# Altium project XP-LRCU-L LoadBox-wiring drawing.PrjPcb
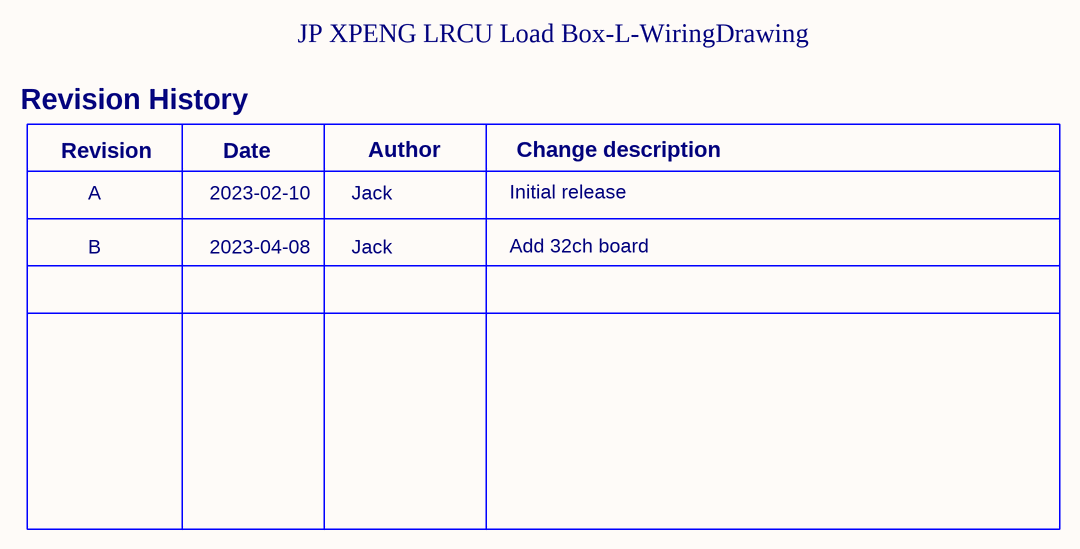
[diagram p0: 0_wiring drawing.SchDoc]
6 sheets, 242 parts. Net scope: global (net labels, ports and power ports of the same name join across sheets).
Sheets:
  0_wiring drawing.SchDoc
  1_wiring drawing.SchDoc
  2_wiring drawing.SchDoc
  3_wiring drawing.SchDoc
  4_wiring drawing.SchDoc
  5_wiring drawing.SchDoc

## Sheet 0_wiring drawing.SchDoc: History
size A4; CheckedBy: Among; DrawnBy: Jack; Address1: 1; Address2: 2; Address3: 3; Address4: 4; DocumentNumber: 04-TE-42-4015-0PA-A; Revision: B; SheetNumber: 1; SheetTotal: 5; SheetSize: A4; CheckedByDate: 2022-01-11; DrawByDate: 2022-01-11; SiteName: Huangpu Test Development; ProjectName: 19205_BMW CCU DDR PCBA FT fixture wiring

### Notes on the sheet
- JP XPENG LRCU Load Box-L-WiringDrawing
- Revision History
- Revision
- Date
- Author
- Change description
- A
- B
- 2023-02-10
- 2023-04-08
- Jack
- Initial release
- Add 32ch board
- Document Number:
- Project Name:
- Rev:
- Drawn By:
- Date:
- Titile:
- Checked By:
- Sheet:
- Of

## Sheet 1_wiring drawing.SchDoc: POWER & CAN
size A2; ApprovedBy: Approved By; CheckedBy: Sky; DrawnBy: Jack; Address1: 1; Address2: 2; Address3: 3; Address4: 4; DocumentNumber: 04-TE-42-4015-0PA-A; Revision: B; SheetNumber: 2; SheetTotal: 6; SheetSize: A2; CheckedByDate: 2022-11-19; DrawByDate: 2022-11-17; SiteName: EMS TD Huangpu; PageSetup: Record=PageOptions|CenterHorizontal=True|CenterVertical=True|PrintScale=0.73|XCorrection=1.00|YCorrection=1.00|PrintKind=0|BorderSize=5000000|LeftOffset=0|BottomOffset=0|Orientation=2|PaperLength=1000|PaperWidth=1000|Scale=100|PaperSource=15|PrintQuality=1200|MediaType=1|DitherType=10|PaperKind=A3|PrintScaleMode=1; ProjectName: 19205_BMW CCU DDR PCBA FT fixture wiring
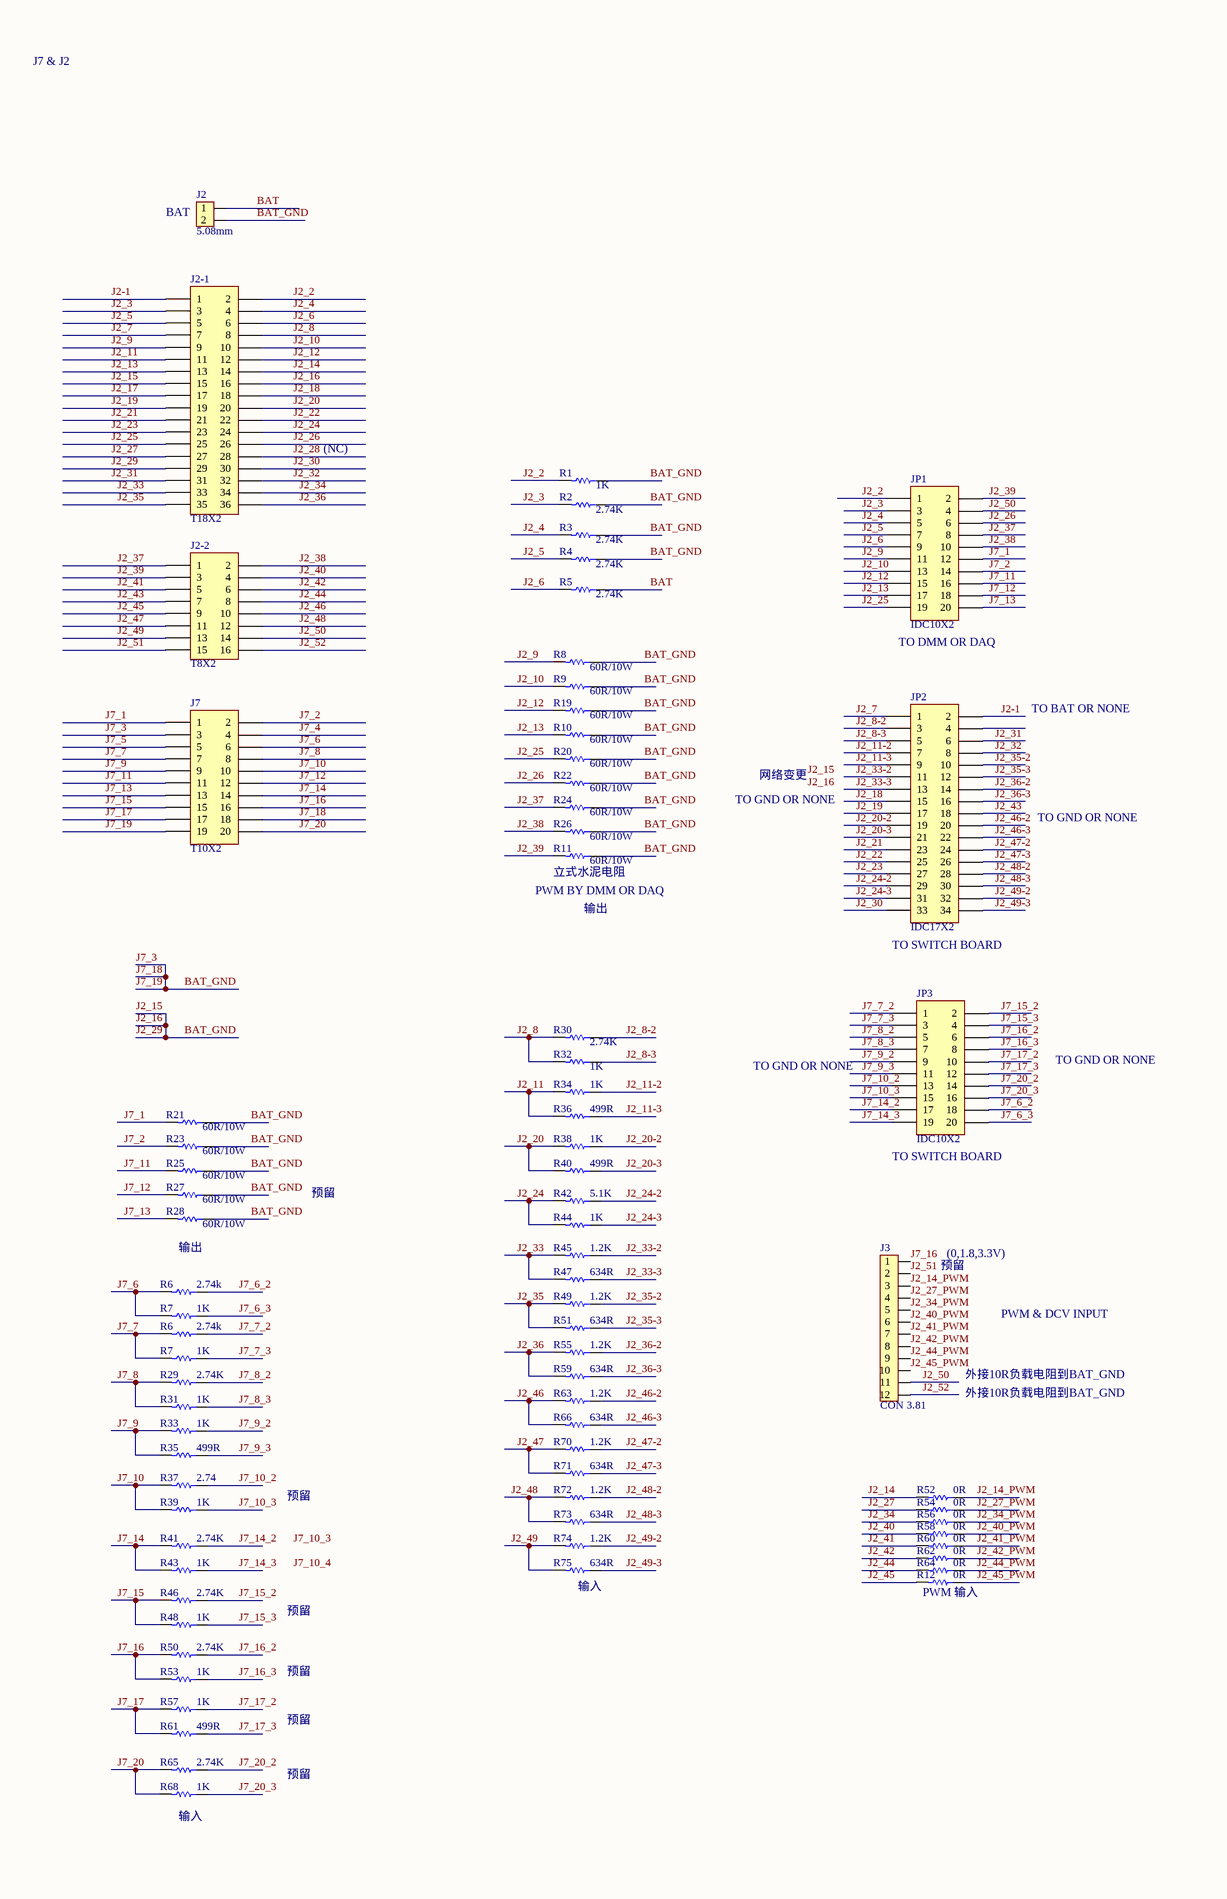
[diagram p1: 1_wiring drawing.SchDoc, left]
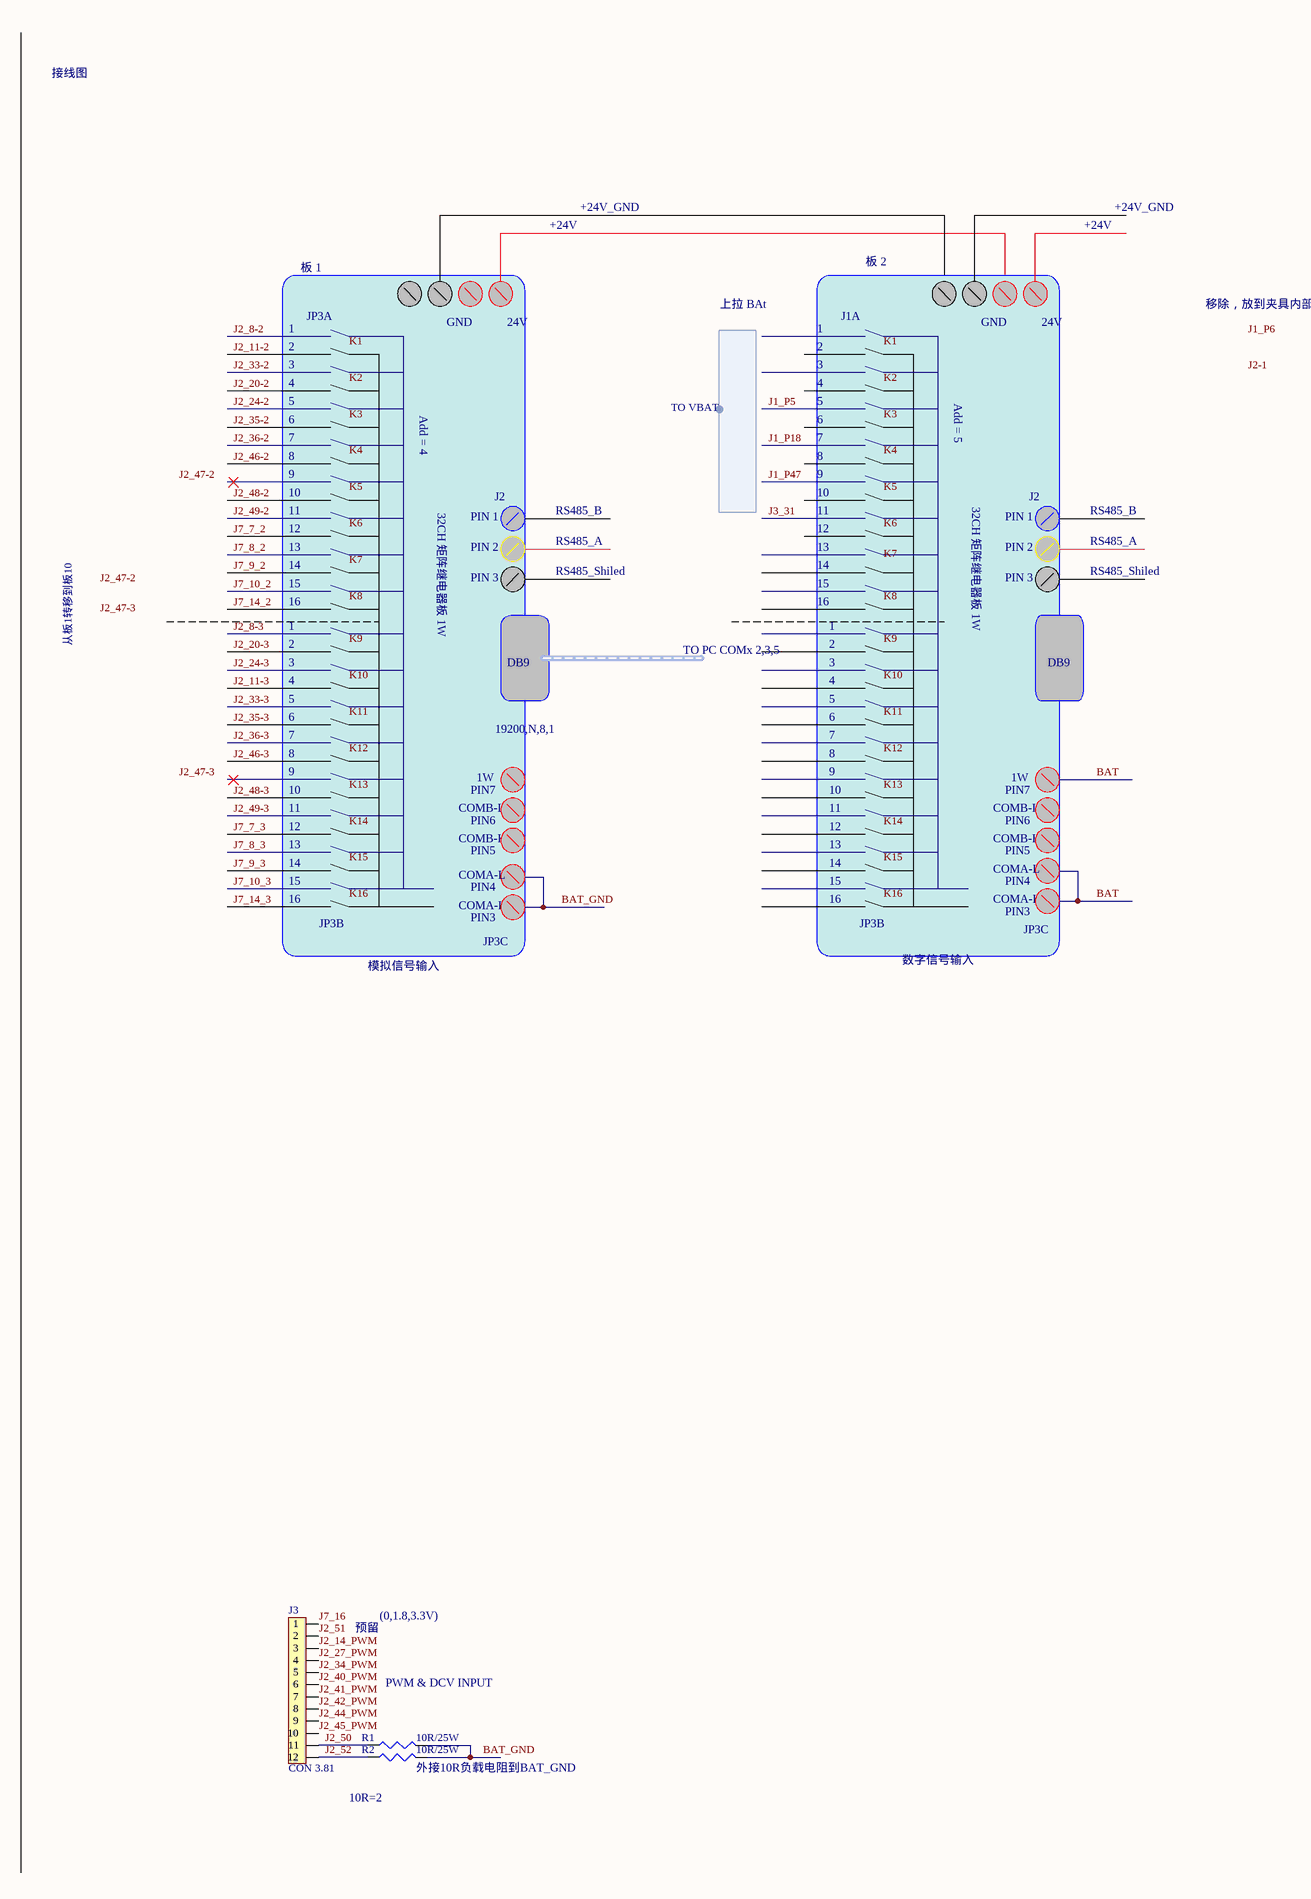
[diagram p2: 1_wiring drawing.SchDoc, right]

### Parts
(Parts that share a designator on the sheet are numbered #1, #2 ... from top to bottom, then left to right.)
J2  5.08mm  [3.81mm-2]
J2-1  T18X2  [T18X2-bend]
J2-2  T8X2
J3#1  CON 3.81  [3.81mm-12]
J3#2  CON 3.81  [3.81mm-12]
J7  T10X2  [T10X2-bend]
JP1#1  IDC10X2  [IDC20]
JP2  IDC17X2  [IDC34]
JP3  IDC10X2  [IDC20]
R1#1  1K  [AXIAL-0.25W]
R1#2  10R/25W  [R AXIAL0.4]
R2#1  2.74K  [AXIAL-0.25W]
R2#2  10R/25W  [R AXIAL0.4]
R3#1  2.74K  [AXIAL-0.25W]
R4#1  2.74K  [AXIAL-0.25W]
R5#1  2.74K  [AXIAL-0.25W]
R6#1  2.74k  [AXIAL-0.25W]
R6#2  2.74k  [AXIAL-0.25W]
R7#1  1K  [AXIAL-0.25W]
R7#2  1K  [AXIAL-0.25W]
R8#1  60R/10W  [立式10W]
R9#1  60R/10W  [立式10W]
R10#1  60R/10W  [立式10W]
R11#1  60R/10W  [立式10W]
R12#1  0R  [AXIAL-0.25W]
R19#1  60R/10W  [立式10W]
R20  60R/10W  [立式10W]
R21  60R/10W  [立式10W]
R22  60R/10W  [立式10W]
R23  60R/10W  [立式10W]
R24  60R/10W  [立式10W]
R25  60R/10W  [立式10W]
R26  60R/10W  [立式10W]
R27  60R/10W  [立式10W]
R28  60R/10W  [立式10W]
R29  2.74K  [AXIAL-0.25W]
R30  2.74K  [AXIAL-0.25W]
R31  1K  [AXIAL-0.25W]
R32  1K  [AXIAL-0.25W]
R33  1K  [AXIAL-0.25W]
R34  1K  [AXIAL-0.25W]
R35  499R  [AXIAL-0.25W]
R36  499R  [AXIAL-0.25W]
R37  2.74  [AXIAL-0.25W]
R38  1K  [AXIAL-0.25W]
R39  1K  [AXIAL-0.25W]
R40  499R  [AXIAL-0.25W]
R41  2.74K  [AXIAL-0.25W]
R42  5.1K  [AXIAL-0.25W]
R43  1K  [AXIAL-0.25W]
R44  1K  [AXIAL-0.25W]
R45  1.2K  [AXIAL-0.25W]
R46  2.74K  [AXIAL-0.25W]
R47  634R  [AXIAL-0.25W]
R48  1K  [AXIAL-0.25W]
R49  1.2K  [AXIAL-0.25W]
R50  2.74K  [AXIAL-0.25W]
R51  634R  [AXIAL-0.25W]
R52  0R  [AXIAL-0.25W]
R53  1K  [AXIAL-0.25W]
R54  0R  [AXIAL-0.25W]
R55  1.2K  [AXIAL-0.25W]
R56  0R  [AXIAL-0.25W]
R57  1K  [AXIAL-0.25W]
R58  0R  [AXIAL-0.25W]
R59  634R  [AXIAL-0.25W]
R60  0R  [AXIAL-0.25W]
R61  499R  [AXIAL-0.25W]
R62  0R  [AXIAL-0.25W]
R63  1.2K  [AXIAL-0.25W]
R64  0R  [AXIAL-0.25W]
R65  2.74K  [AXIAL-0.25W]
R66  634R  [AXIAL-0.25W]
R68  1K  [AXIAL-0.25W]
R70  1.2K  [AXIAL-0.25W]
R71  634R  [AXIAL-0.25W]
R72  1.2K  [AXIAL-0.25W]
R73  634R  [AXIAL-0.25W]
R74  1.2K  [AXIAL-0.25W]
R75  634R  [AXIAL-0.25W]

### Harnesses
TO VBAT: 

### Nets
BAT_GND: J2.2 J2-1.15 J2-1.16 J2-1.29 J7.3 J7.18 J7.19 R1#1.2 R1#2.2 R2#1.2 R2#2.2 R3#1.2 R4#1.2 R8#1.2 R9#1.2 R10#1.2 R11#1.2 R19#1.2 R20.2 R21.2 R22.2 R23.2 R24.2 R25.2 R26.2 R27.2 R28.2  [also labelled J2_15, J2_16, J2_29, J7_18, J7_19, J7_3]
BAT: J2.1 R5#1.2
J2-1: J2-1.1 JP2.2
J2_2: J2-1.2 JP1#1.1 R1#1.1
J2_3: J2-1.3 JP1#1.3 R2#1.1
J2_4: J2-1.4 JP1#1.5 R3#1.1
J2_5: J2-1.5 JP1#1.7 R4#1.1
J2_6: J2-1.6 JP1#1.9 R5#1.1
J2_7: J2-1.7 JP2.1
J2_8: J2-1.8 R30.1 R32.1
J2_8-2: JP2.3 R30.2
J2_8-3: JP2.5 R32.2
J2_9: J2-1.9 JP1#1.11 R8#1.1
J2_10: J2-1.10 JP1#1.13 R9#1.1
J2_11: J2-1.11 R34.1 R36.1
J2_11-2: JP2.7 R34.2
J2_11-3: JP2.9 R36.2
J2_12: J2-1.12 JP1#1.15 R19#1.1
J2_13: J2-1.13 JP1#1.17 R10#1.1
J2_14: J2-1.14 R52.1
J2_14_PWM: J3#1.3 J3#2.3 R52.2
J2_17: J2-1.17
J2_18: J2-1.18 JP2.15
J2_19: J2-1.19 JP2.17
J2_20: J2-1.20 R38.1 R40.1
J2_20-2: JP2.19 R38.2
J2_20-3: JP2.21 R40.2
J2_21: J2-1.21 JP2.23
J2_22: J2-1.22 JP2.25
J2_23: J2-1.23 JP2.27
J2_24: J2-1.24 R42.1 R44.1
J2_24-2: JP2.29 R42.2
J2_24-3: JP2.31 R44.2
J2_25: J2-1.25 JP1#1.19 R20.1
J2_26: J2-1.26 JP1#1.6 R22.1
J2_27: J2-1.27 R54.1
J2_27_PWM: J3#1.4 J3#2.4 R54.2
J2_28: J2-1.28
J2_30: J2-1.30 JP2.33
J2_31: J2-1.31 JP2.6
J2_32: J2-1.32 JP2.8
J2_33: J2-1.33 R45.1 R47.1
J2_33-2: JP2.11 R45.2
J2_33-3: JP2.13 R47.2
J2_34: J2-1.34 R56.1
J2_34_PWM: J3#1.5 J3#2.5 R56.2
J2_35: J2-1.35 R49.1 R51.1
J2_35-2: JP2.10 R49.2
J2_35-3: JP2.12 R51.2
J2_36: J2-1.36 R55.1 R59.1
J2_36-2: JP2.14 R55.2
J2_36-3: JP2.16 R59.2
J2_37: J2-2.1 JP1#1.8 R24.1
J2_38: J2-2.2 JP1#1.10 R26.1
J2_39: J2-2.3 JP1#1.2 R11#1.1
J2_40: J2-2.4 R58.1
J2_40_PWM: J3#1.6 J3#2.6 R58.2
J2_41: J2-2.5 R60.1
J2_41_PWM: J3#1.7 J3#2.7 R60.2
J2_42: J2-2.6 R62.1
J2_42_PWM: J3#1.8 J3#2.8 R62.2
J2_43: J2-2.7 JP2.18
J2_44: J2-2.8 R64.1
J2_44_PWM: J3#1.9 J3#2.9 R64.2
J2_45: J2-2.9 R12#1.1
J2_45_PWM: J3#1.10 J3#2.10 R12#1.2
J2_46: J2-2.10 R63.1 R66.1
J2_46-2: JP2.20 R63.2
J2_46-3: JP2.22 R66.2
J2_47: J2-2.11 R70.1 R71.1
J2_47-2: JP2.24 R70.2
J2_47-3: JP2.26 R71.2
J2_48: J2-2.12 R72.1 R73.1
J2_48-2: JP2.28 R72.2
J2_48-3: JP2.30 R73.2
J2_49: J2-2.13 R74.1 R75.1
J2_49-2: JP2.32 R74.2
J2_49-3: JP2.34 R75.2
J2_50: J2-2.14 J3#1.11 J3#2.11 JP1#1.4 R1#2.1
J2_51: J2-2.15 J3#1.2 J3#2.2
J2_52: J2-2.16 J3#1.12 J3#2.12 R2#2.1
J7_1: J7.1 JP1#1.12 R21.1
J7_2: J7.2 JP1#1.14 R23.1
J7_4: J7.4
J7_5: J7.5
J7_6: J7.6 R6#1.1 R7#1.1
J7_6_2: JP3.18 R6#1.2
J7_6_3: JP3.20 R7#1.2
J7_7: J7.7 R6#2.1 R7#2.1
J7_7_2: JP3.1 R6#2.2
J7_7_3: JP3.3 R7#2.2
J7_8: J7.8 R29.1 R31.1
J7_8_2: JP3.5 R29.2
J7_8_3: JP3.7 R31.2
J7_9: J7.9 R33.1 R35.1
J7_9_2: JP3.9 R33.2
J7_9_3: JP3.11 R35.2
J7_10: J7.10 R37.1 R39.1
J7_10_2: JP3.13 R37.2
J7_10_3: JP3.15 R39.2
J7_11: J7.11 JP1#1.16 R25.1
J7_12: J7.12 JP1#1.18 R27.1
J7_13: J7.13 JP1#1.20 R28.1
J7_14: J7.14 R41.1 R43.1
J7_14_2: JP3.17 R41.2
J7_14_3: JP3.19 R43.2
J7_15: J7.15 R46.1 R48.1
J7_15_2: JP3.2 R46.2
J7_15_3: JP3.4 R48.2
J7_16: J3#1.1 J3#2.1 J7.16 R50.1 R53.1
J7_16_2: JP3.6 R50.2
J7_16_3: JP3.8 R53.2
J7_17: J7.17 R57.1 R61.1
J7_17_2: JP3.10 R57.2
J7_17_3: JP3.12 R61.2
J7_20: J7.20 R65.1 R68.1
J7_20_2: JP3.14 R65.2
J7_20_3: JP3.16 R68.2

Not connected (* = marked no-connect by the designer): JP2 4

### Notes on the sheet
- J7 & J2
- 接线图
- (near J2) BAT
- +24V
- +24V_GND
- 板 1
- 板 2
- 1
- 2
- JP3A
- GND
- 24V
- 上拉 BAt
- J1A
- 移除，放到夹具内部
- 3
- 4
- 5
- Add = 5
- (NC)
- 6
- 7
- 8
- Add = 4
- 9
- 10
- 11
- 32CH 矩阵继电器板 1W
- PIN 1
- J2
- RS485_B
- 12
- 13
- 14
- 15
- PIN 2
- PIN 3
- RS485_A
- RS485_Shiled
- (near JP1#1) TO DMM OR DAQ
- 从板1转移到板10
- 16
- TO BAT OR NONE
- DB9
- TO PC COMx 2,3,5
- 19200,N,8,1
- TO GND OR NONE
- 网络变更
- COMB-L
- PIN6
- PIN7
- 1W
- (near R11#1) 立式水泥电阻
- COMB-H
- COMA-L
- PIN4
- PIN5
- (near R11#1) PWM BY DMM OR DAQ
- 输出
- (near JP2) TO SWITCH BOARD
- JP3B
- COMA-H
- PIN3
- JP3C
- 模拟信号输入
- 数字信号输入
- 预留
- (near JP3) TO SWITCH BOARD
- (near J3#1) 预留
- (0,1.8,3.3V)
- PWM & DCV INPUT
- 外接10R负载电阻到BAT_GND
- (near R75) 输入
- (near R12#1) PWM 输入
- 10R=2
- (near R2#2) 外接10R负载电阻到BAT_GND
- (near R68) 输入
- Labels drawn without touching a wire or pin: J1_P5, J1_P6, J1_P18, J1_P47, J2-1, J2_8-2, J2_8-3, J2_11-2, J2_11-3, J2_15, J2_16, J2_20-2, J2_20-3, J2_24-2, J2_24-3, J2_33-2, J2_33-3, J2_35-2, J2_35-3, J2_36-2, J2_36-3, J2_46-2, J2_46-3, J2_47-2, J2_47-3, J2_48-2, J2_48-3, J2_49-2, J2_49-3, J3_31, J7_7_2, J7_7_3, J7_8_2, J7_8_3, J7_9_2, J7_9_3, J7_10_2, J7_10_3, J7_10_4, J7_14_2, J7_14_3, K1, K2, K3, K4, K5, K6, K7, K8, K9, K10, K11, K12, K13, K14, K15, K16
- Document Number:
- Rev:
- YUANCHEN
- 源 辰
- Project Name:
- Drawn By:
- Date:
- Titile:
- Checked By:
- Sheet:
- Of

### Library data of the parts
J2 = CON2-3.81
J3#1 J3#2 = CON12-2.54
J7 = IDC10X2
R1#1 R2#1 R3#1 R4#1 R5#1 R6#1 R6#2 R7#1 R7#2 R8#1 R9#1 R10#1 R11#1 R12#1 R19#1 R20-R66 R68 R70-R75 = RES1
R1#2 R2#2 = RES2

## Sheet 2_wiring drawing.SchDoc: POWER & CAN
size A2; ApprovedBy: Approved By; CheckedBy: Sky Ma; DrawnBy: Jack; Address1: 1; Address2: 2; Address3: 3; Address4: 4; DocumentNumber: 04-TE-42-4015-0PA-A; Revision: B; SheetNumber: 3; SheetTotal: 6; SheetSize: A2; CheckedByDate: 2022-12-5; DrawByDate: 2022-12-5; SiteName: EMS TD Huangpu; : Record=PageOptions|CenterHorizontal=True|CenterVertical=True|PrintScale=0.73|XCorrection=1.00|YCorrection=1.00|PrintKind=0|BorderSize=5000000|LeftOffset=0|BottomOffset=0|Orientation=2|PaperLength=1000|PaperWidth=1000|Scale=100|PaperSource=15|PrintQuality=1200|MediaType=1|DitherType=10|PaperKind=A3|Pr; PageSetup: Record=PageOptions|CenterHorizontal=True|CenterVertical=True|PrintScale=0.52|XCorrection=1.00|YCorrection=1.00|PrintKind=0|BorderSize=5000000|LeftOffset=0|BottomOffset=0|Orientation=2|PaperLength=1000|PaperWidth=1000|Scale=100|PaperSource=15|PrintQuality=1200|MediaType=1|DitherType=10|PaperKind=A4|PrintScaleMode=1; ProjectName: 19205_BMW CCU DDR PCBA FT fixture wiring
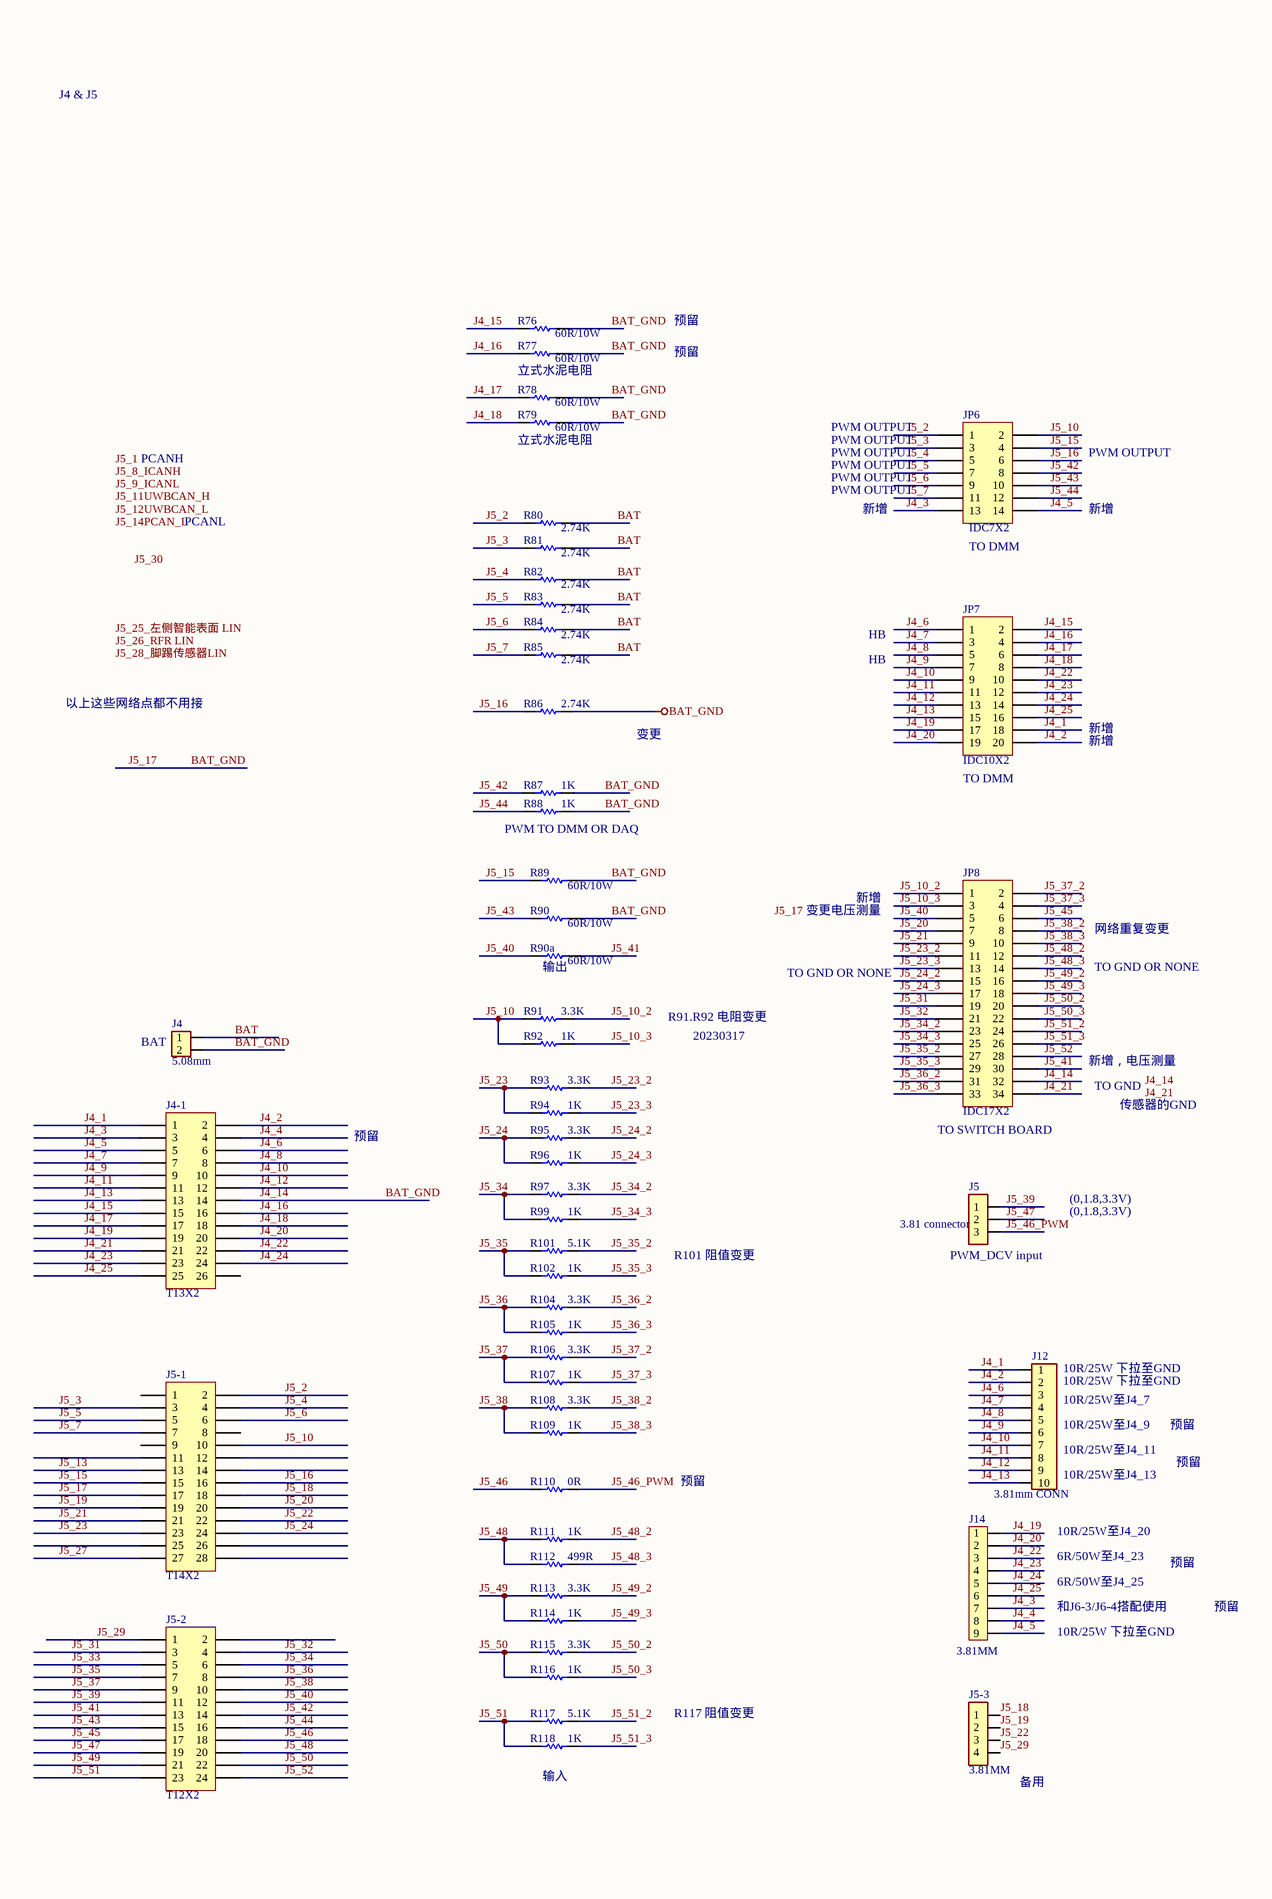
[diagram p3: 2_wiring drawing.SchDoc, left]
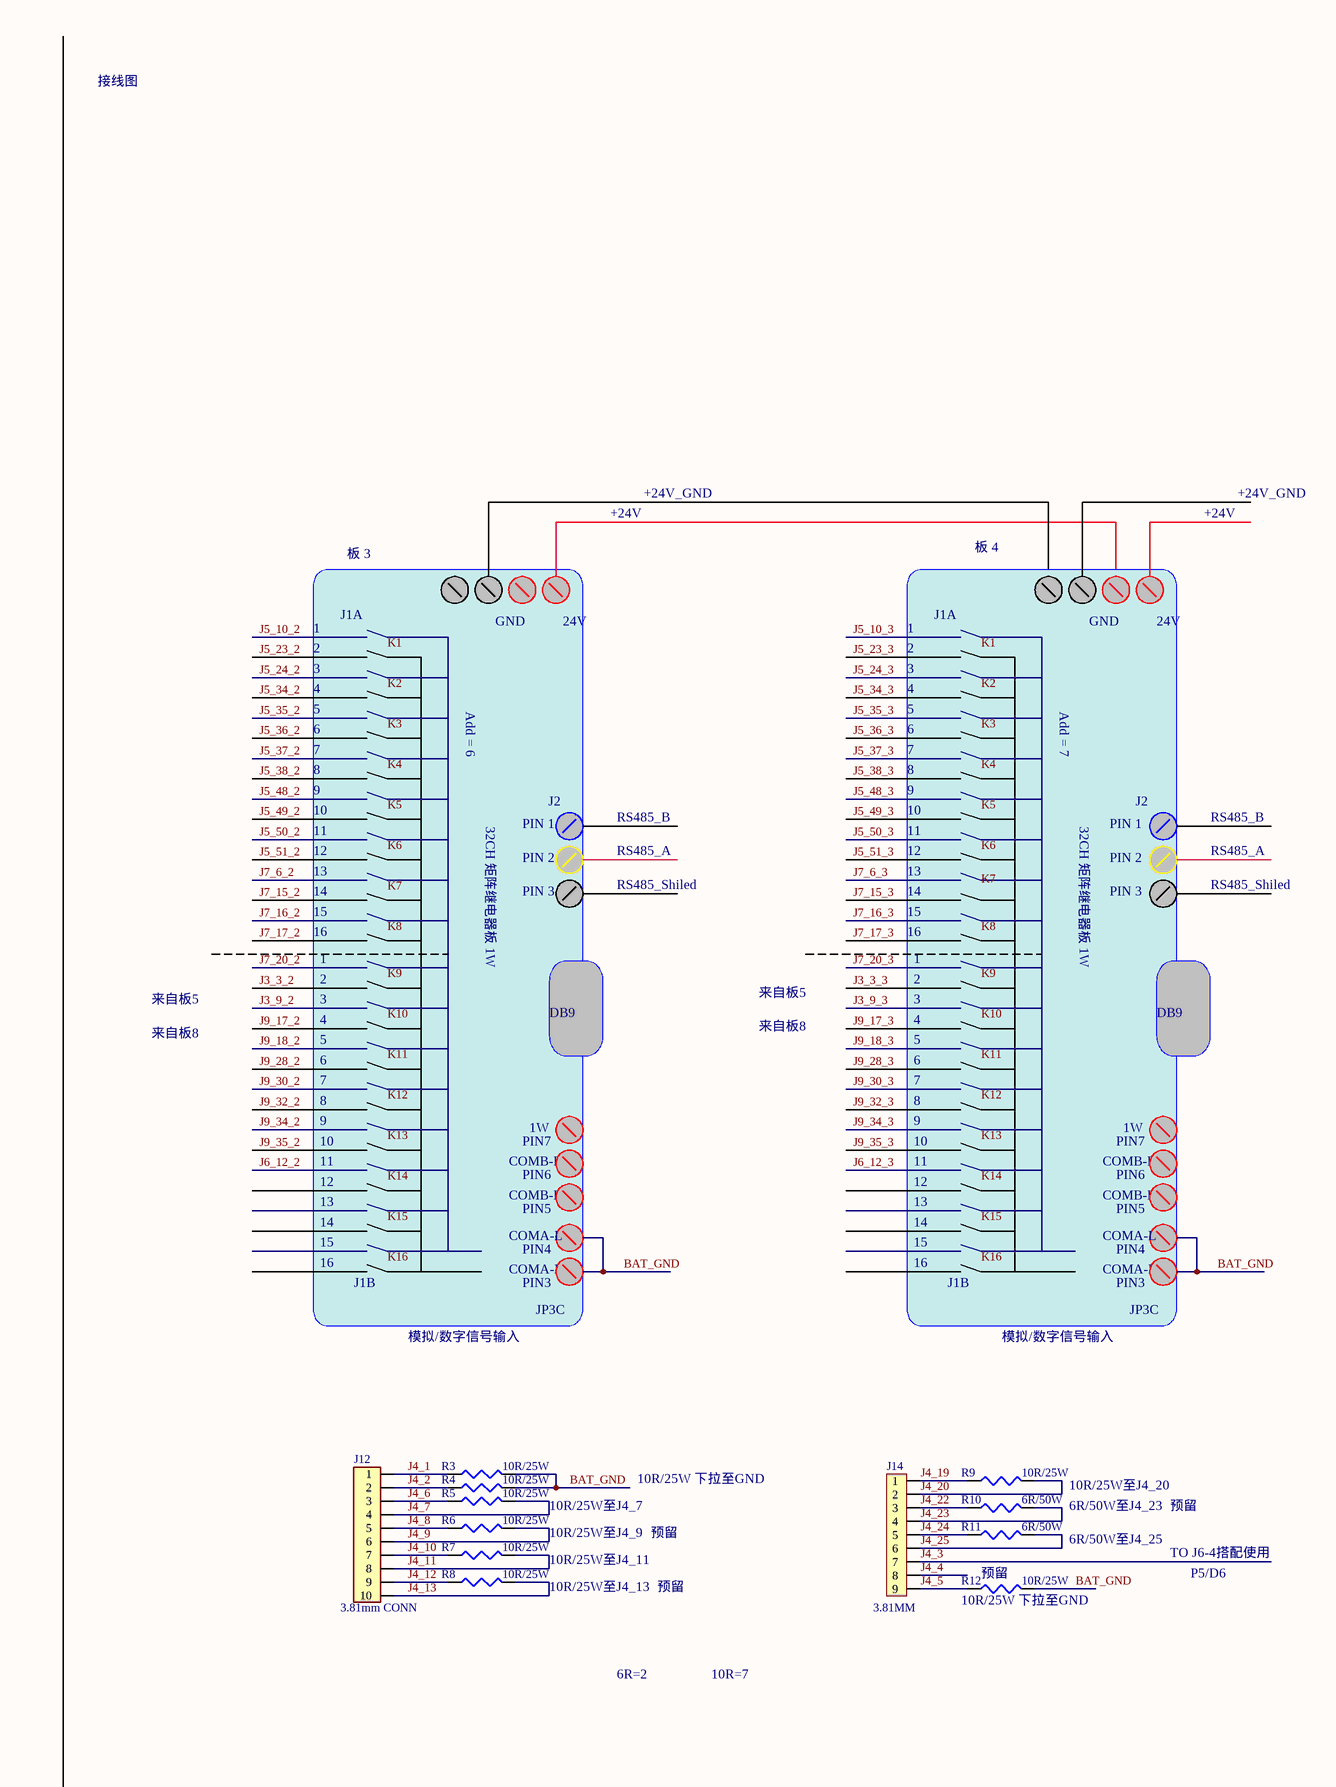
[diagram p4: 2_wiring drawing.SchDoc, right]

### Parts
(Parts that share a designator on the sheet are numbered #1, #2 ... from top to bottom, then left to right.)
J4  5.08mm  [3.81mm-2]
J4-1  T13X2  [T13X2-bend]
J5  3.81 connector  [3.81mm-3]
J5-1  T14X2  [T14X2-bend]
J5-2  T12X2  [T12X2-bend]
J5-3  3.81MM  [3.81mm-4]
J12#1  3.81mm CONN  [3.81mm-10]
J12#2  3.81mm CONN  [3.81mm-10]
J14#1  3.81MM  [3.81mm-9]
J14#2  3.81MM  [3.81mm-9]
JP6#1  IDC7X2  [IDC14]
JP7#1  IDC10X2  [IDC20]
JP8  IDC17X2  [IDC34]
R3#2  10R/25W  [R AXIAL0.4]
R4#2  10R/25W  [R AXIAL0.4]
R5#2  10R/25W  [R AXIAL0.4]
R6#3  10R/25W  [R AXIAL0.4]
R7#3  10R/25W  [R AXIAL0.4]
R8#2  10R/25W  [R AXIAL0.4]
R9#2  10R/25W  [R AXIAL0.4]
R10#2  6R/50W  [R AXIAL0.4]
R11#2  6R/50W  [R AXIAL0.4]
R12#2  10R/25W  [R AXIAL0.4]
R76  60R/10W  [立式10W]
R77  60R/10W  [立式10W]
R78  60R/10W  [立式10W]
R79  60R/10W  [立式10W]
R80  2.74K  [AXIAL-0.25W]
R81  2.74K  [AXIAL-0.25W]
R82  2.74K  [AXIAL-0.25W]
R83  2.74K  [AXIAL-0.25W]
R84  2.74K  [AXIAL-0.25W]
R85  2.74K  [AXIAL-0.25W]
R86  2.74K  [AXIAL-0.25W]
R87  1K  [AXIAL-0.25W]
R88  1K  [AXIAL-0.25W]
R89  60R/10W  [立式10W]
R90  60R/10W  [立式10W]
R90a  60R/10W  [立式10W]
R91  3.3K  [AXIAL-0.25W]
R92  1K  [AXIAL-0.25W]
R93  3.3K  [AXIAL-0.25W]
R94  1K  [AXIAL-0.25W]
R95  3.3K  [AXIAL-0.25W]
R96  1K  [AXIAL-0.25W]
R97  3.3K  [AXIAL-0.25W]
R99  1K  [AXIAL-0.25W]
R101  5.1K  [AXIAL-0.25W]
R102  1K  [AXIAL-0.25W]
R104  3.3K  [AXIAL-0.25W]
R105  1K  [AXIAL-0.25W]
R106  3.3K  [AXIAL-0.25W]
R107  1K  [AXIAL-0.25W]
R108  3.3K  [AXIAL-0.25W]
R109  1K  [AXIAL-0.25W]
R110  0R  [AXIAL-0.25W]
R111  1K  [AXIAL-0.25W]
R112  499R  [AXIAL-0.25W]
R113  3.3K  [AXIAL-0.25W]
R114  1K  [AXIAL-0.25W]
R115  3.3K  [AXIAL-0.25W]
R116  1K  [AXIAL-0.25W]
R117  5.1K  [AXIAL-0.25W]
R118  1K  [AXIAL-0.25W]

### Nets
BAT_GND: J4.2 J4-1.14 J5-1.17 JP8.32 R3#2.2 R4#2.2 R12#2.2 R76.2 R77.2 R78.2 R79.2 R86.2 R87.2 R88.2 R89.2 R90.2  [also labelled J4_14, J5_17]
BAT: J4.1 R80.2 R81.2 R82.2 R83.2 R84.2 R85.2
J4_1: J4-1.1 J12#1.1 J12#2.1 JP7#1.18 R3#2.1
J4_2: J4-1.2 J12#1.2 J12#2.2 JP7#1.20 R4#2.1
J4_3: J4-1.3 J14#1.7 J14#2.7 JP6#1.13
J4_4: J4-1.4 J14#1.8 J14#2.8
J4_5: J4-1.5 J14#1.9 J14#2.9 JP6#1.14 R12#2.1
J4_6: J4-1.6 J12#1.3 J12#2.3 JP7#1.1 R5#2.1
J4_7: J4-1.7 J12#1.4 J12#2.4 JP7#1.3 R5#2.2
J4_8: J4-1.8 J12#1.5 J12#2.5 JP7#1.5 R6#3.1
J4_9: J4-1.9 J12#1.6 J12#2.6 JP7#1.7 R6#3.2
J4_10: J4-1.10 J12#1.7 J12#2.7 JP7#1.9 R7#3.1
J4_11: J4-1.11 J12#1.8 J12#2.8 JP7#1.11 R7#3.2
J4_12: J4-1.12 J12#1.9 J12#2.9 JP7#1.13 R8#2.1
J4_13: J4-1.13 J12#1.10 J12#2.10 JP7#1.15 R8#2.2
J4_15: J4-1.15 JP7#1.2 R76.1
J4_16: J4-1.16 JP7#1.4 R77.1
J4_17: J4-1.17 JP7#1.6 R78.1
J4_18: J4-1.18 JP7#1.8 R79.1
J4_19: J4-1.19 J14#1.1 J14#2.1 JP7#1.17 R9#2.1
J4_20: J4-1.20 J14#1.2 J14#2.2 JP7#1.19 R9#2.2
J4_21: J4-1.21 JP8.34
J4_22: J4-1.22 J14#1.3 J14#2.3 JP7#1.10 R10#2.1
J4_23: J4-1.23 J14#1.4 J14#2.4 JP7#1.12 R10#2.2
J4_24: J4-1.24 J14#1.5 J14#2.5 JP7#1.14 R11#2.1
J4_25: J4-1.25 J14#1.6 J14#2.6 JP7#1.16 R11#2.2
J5_2: J5-1.2 JP6#1.1 R80.1
J5_3: J5-1.3 JP6#1.3 R81.1
J5_4: J5-1.4 JP6#1.5 R82.1
J5_5: J5-1.5 JP6#1.7 R83.1
J5_6: J5-1.6 JP6#1.9 R84.1
J5_7: J5-1.7 JP6#1.11 R85.1
J5_10: J5-1.10 JP6#1.2 R91.1 R92.1
J5_10_2: JP8.1 R91.2
J5_10_3: JP8.3 R92.2
J5_13: J5-1.13
J5_15: J5-1.15 JP6#1.4 R89.1
J5_16: J5-1.16 JP6#1.6 R86.1
J5_18: J5-1.18 J5-3.1
J5_19: J5-1.19 J5-3.2
J5_20: J5-1.20 JP8.7
J5_21: J5-1.21 JP8.9
J5_22: J5-1.22 J5-3.3
J5_23: J5-1.23 R93.1 R94.1
J5_23_2: JP8.11 R93.2
J5_23_3: JP8.13 R94.2
J5_24: J5-1.24 R95.1 R96.1
J5_24_2: JP8.15 R95.2
J5_24_3: JP8.17 R96.2
J5_27: J5-1.27
J5_29: J5-2.1 J5-3.4
J5_31: J5-2.3 JP8.19
J5_32: J5-2.4 JP8.21
J5_33: J5-2.5
J5_34: J5-2.6 R97.1 R99.1
J5_34_2: JP8.23 R97.2
J5_34_3: JP8.25 R99.2
J5_35: J5-2.7 R101.1 R102.1
J5_35_2: JP8.27 R101.2
J5_35_3: JP8.29 R102.2
J5_36: J5-2.8 R104.1 R105.1
J5_36_2: JP8.31 R104.2
J5_36_3: JP8.33 R105.2
J5_37: J5-2.9 R106.1 R107.1
J5_37_2: JP8.2 R106.2
J5_37_3: JP8.4 R107.2
J5_38: J5-2.10 R108.1 R109.1
J5_38_2: JP8.8 R108.2
J5_38_3: JP8.10 R109.2
J5_39: J5.1 J5-2.11
J5_40: J5-2.12 JP8.5 R90a.1
J5_41: J5-2.13 JP8.30 R90a.2
J5_42: J5-2.14 JP6#1.8 R87.1
J5_43: J5-2.15 JP6#1.10 R90.1
J5_44: J5-2.16 JP6#1.12 R88.1
J5_45: J5-2.17 JP8.6
J5_46: J5-2.18 R110.1
J5_46_PWM: J5.3 R110.2
J5_47: J5.2 J5-2.19
J5_48: J5-2.20 R111.1 R112.1
J5_48_2: JP8.12 R111.2
J5_48_3: JP8.14 R112.2
J5_49: J5-2.21 R113.1 R114.1
J5_49_2: JP8.16 R113.2
J5_49_3: JP8.18 R114.2
J5_50: J5-2.22 R115.1 R116.1
J5_50_2: JP8.20 R115.2
J5_50_3: JP8.22 R116.2
J5_51: J5-2.23 R117.1 R118.1
J5_51_2: JP8.24 R117.2
J5_51_3: JP8.26 R118.2
J5_52: J5-2.24 JP8.28

Not connected (* = marked no-connect by the designer): J4-1 26; J5-1 1 8 9 11 12 14 25 26 28; J5-2 2

### Notes on the sheet
- J4 & J5
- 接线图
- 预留
- 立式水泥电阻
- PCANH
- (near R79) 立式水泥电阻
- PWM OUTPUT
- +24V
- +24V_GND
- PCANL
- 新增
- 板 3
- 板 4
- (near JP6#1) TO DMM
- 1
- 2
- J1A
- GND
- 24V
- HB
- 3
- 4
- 5
- Add = 6
- Add = 7
- 以上这些网络点都不用接
- 变更
- 6
- 7
- 8
- 9
- J2
- (near JP7#1) TO DMM
- 10
- 11
- 12
- 32CH 矩阵继电器板 1W
- PIN 1
- PIN 2
- RS485_B
- RS485_A
- (near R88) PWM TO DMM OR DAQ
- 13
- 14
- 15
- 16
- PIN 3
- RS485_Shiled
- 变更电压测量
- 来自板5
- (near R90a) 输出
- TO GND OR NONE
- 网络重复变更
- 来自板8
- DB9
- (near J4) BAT
- R91.R92 电阻变更
- 20230317
- 1W
- 新增，电压测量
- TO GND
- 传感器的GND
- COMB-L
- COMB-H
- PIN6
- PIN7
- (near JP8) TO SWITCH BOARD
- COMA-L
- PIN4
- PIN5
- (0,1.8,3.3V)
- J1B
- 模拟/数字信号输入
- COMA-H
- PIN3
- JP3C
- R101 阻值变更
- (near J5) PWM_DCV input
- (near J12#2) 10R/25W 下拉至GND
- (near J12#2) 10R/25W至J4_7
- 10R/25W至J4_7
- 10R/25W至J4_9
- 10R/25W 下拉至GND
- 10R/25W至J4_20
- 6R/50W至J4_23
- (near J12#2) 10R/25W至J4_9
- (near J12#2) 10R/25W至J4_11
- (near J12#2) 10R/25W至J4_13
- 10R/25W至J4_11
- 10R/25W至J4_13
- (near R12#2) 10R/25W 下拉至GND
- (near R12#2) 预留
- 6R/50W至J4_25
- TO J6-4搭配使用
- P5/D6
- 和J6-3/J6-4搭配使用
- 6R=2
- 10R=7
- R117 阻值变更
- (near R118) 输入
- (near J5-3) 备用
- Labels drawn without touching a wire or pin: J3_3_2, J3_3_3, J3_9_2, J3_9_3, J4_14, J4_21, J5_1, J5_8_ICANH, J5_9_ICANL, J5_10_2, J5_10_3, J5_11UWBCAN_H, J5_12UWBCAN_L, J5_14PCAN_L, J5_17, J5_23_2, J5_23_3, J5_24_2, J5_24_3, J5_25_左侧智能表面 LIN, J5_26_RFR LIN, J5_28_脚踢传感器LIN, J5_30, J5_34_2, J5_34_3, J5_35_2, J5_35_3, J5_36_2, J5_36_3, J5_37_2, J5_37_3, J5_38_2, J5_38_3, J5_48_2, J5_48_3, J5_49_2, J5_49_3, J5_50_2, J5_50_3, J5_51_2, J5_51_3, J6_12_2, J6_12_3, J7_6_2, J7_6_3, J7_15_2, J7_15_3, J7_16_2, J7_16_3, J7_17_2, J7_17_3, J7_20_2, J7_20_3, J9_17_2, J9_17_3, J9_18_2, J9_18_3, J9_28_2, J9_28_3, J9_30_2, J9_30_3, J9_32_2, J9_32_3, J9_34_2, J9_34_3, J9_35_2, J9_35_3, K1, K2, K3, K4, K5, K6, K7, K8, K9, K10, K11, K12, K13, K14, K15, K16
- Document Number:
- Rev:
- Project Name:
- Drawn By:
- Date:
- Titile:
- Checked By:
- Sheet:
- Of

### Library data of the parts
J4 = CON2-3.81
J4-1 = IDC13X2
J5 = CON3-3.81
J5-3 = CON4-3.81
J12#1 J12#2 = CON10-3.81
J14#1 J14#2 = CON9-3.81
R3#2 R4#2 R5#2 R6#3 R7#3 R8#2 R9#2 R10#2 R11#2 R12#2 = RES2
R76-R90 R90a R91-R97 R99 R101 R102 R104-R118 = RES1

## Sheet 3_wiring drawing.SchDoc: IGON & KL15
size A2; ApprovedBy: Approved By; CheckedBy: Sky Ma; DrawnBy: JACK; Address1: 1; Address2: 2; Address3: 3; Address4: 4; DocumentNumber: 04-TE-42-4015-0PA-A; Revision: B; SheetNumber: 4; SheetTotal: 6; SheetSize: A2; CheckedByDate: 2022-12-5; DrawByDate: 2022-12-5; SiteName: EMS TD Huangpu; ProjectName: 19205_BMW CCU DDR PCBA FT fixture wiring
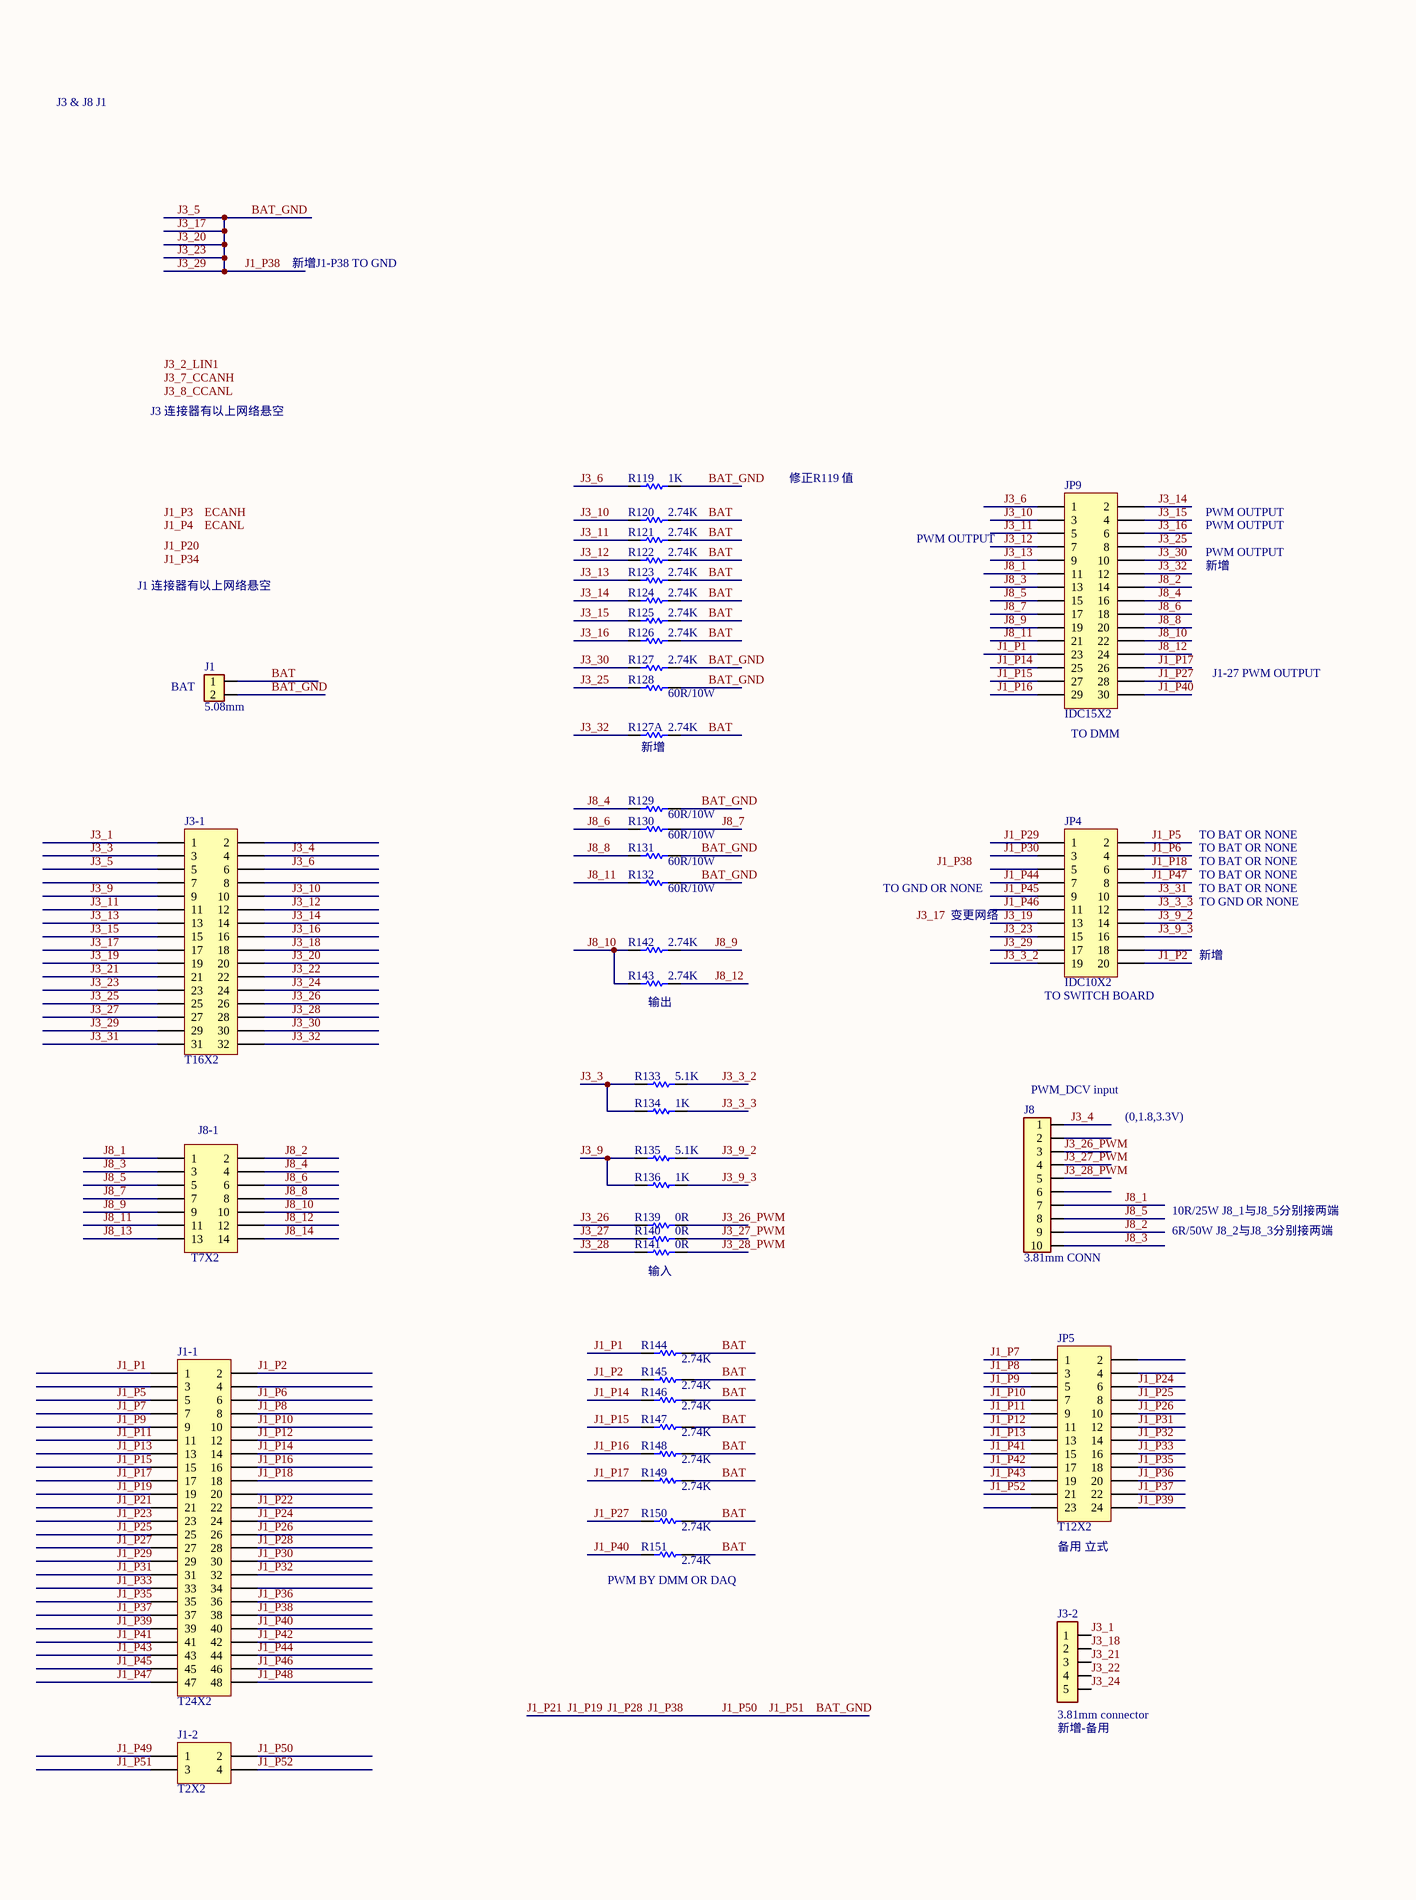
[diagram p5: 3_wiring drawing.SchDoc, left]
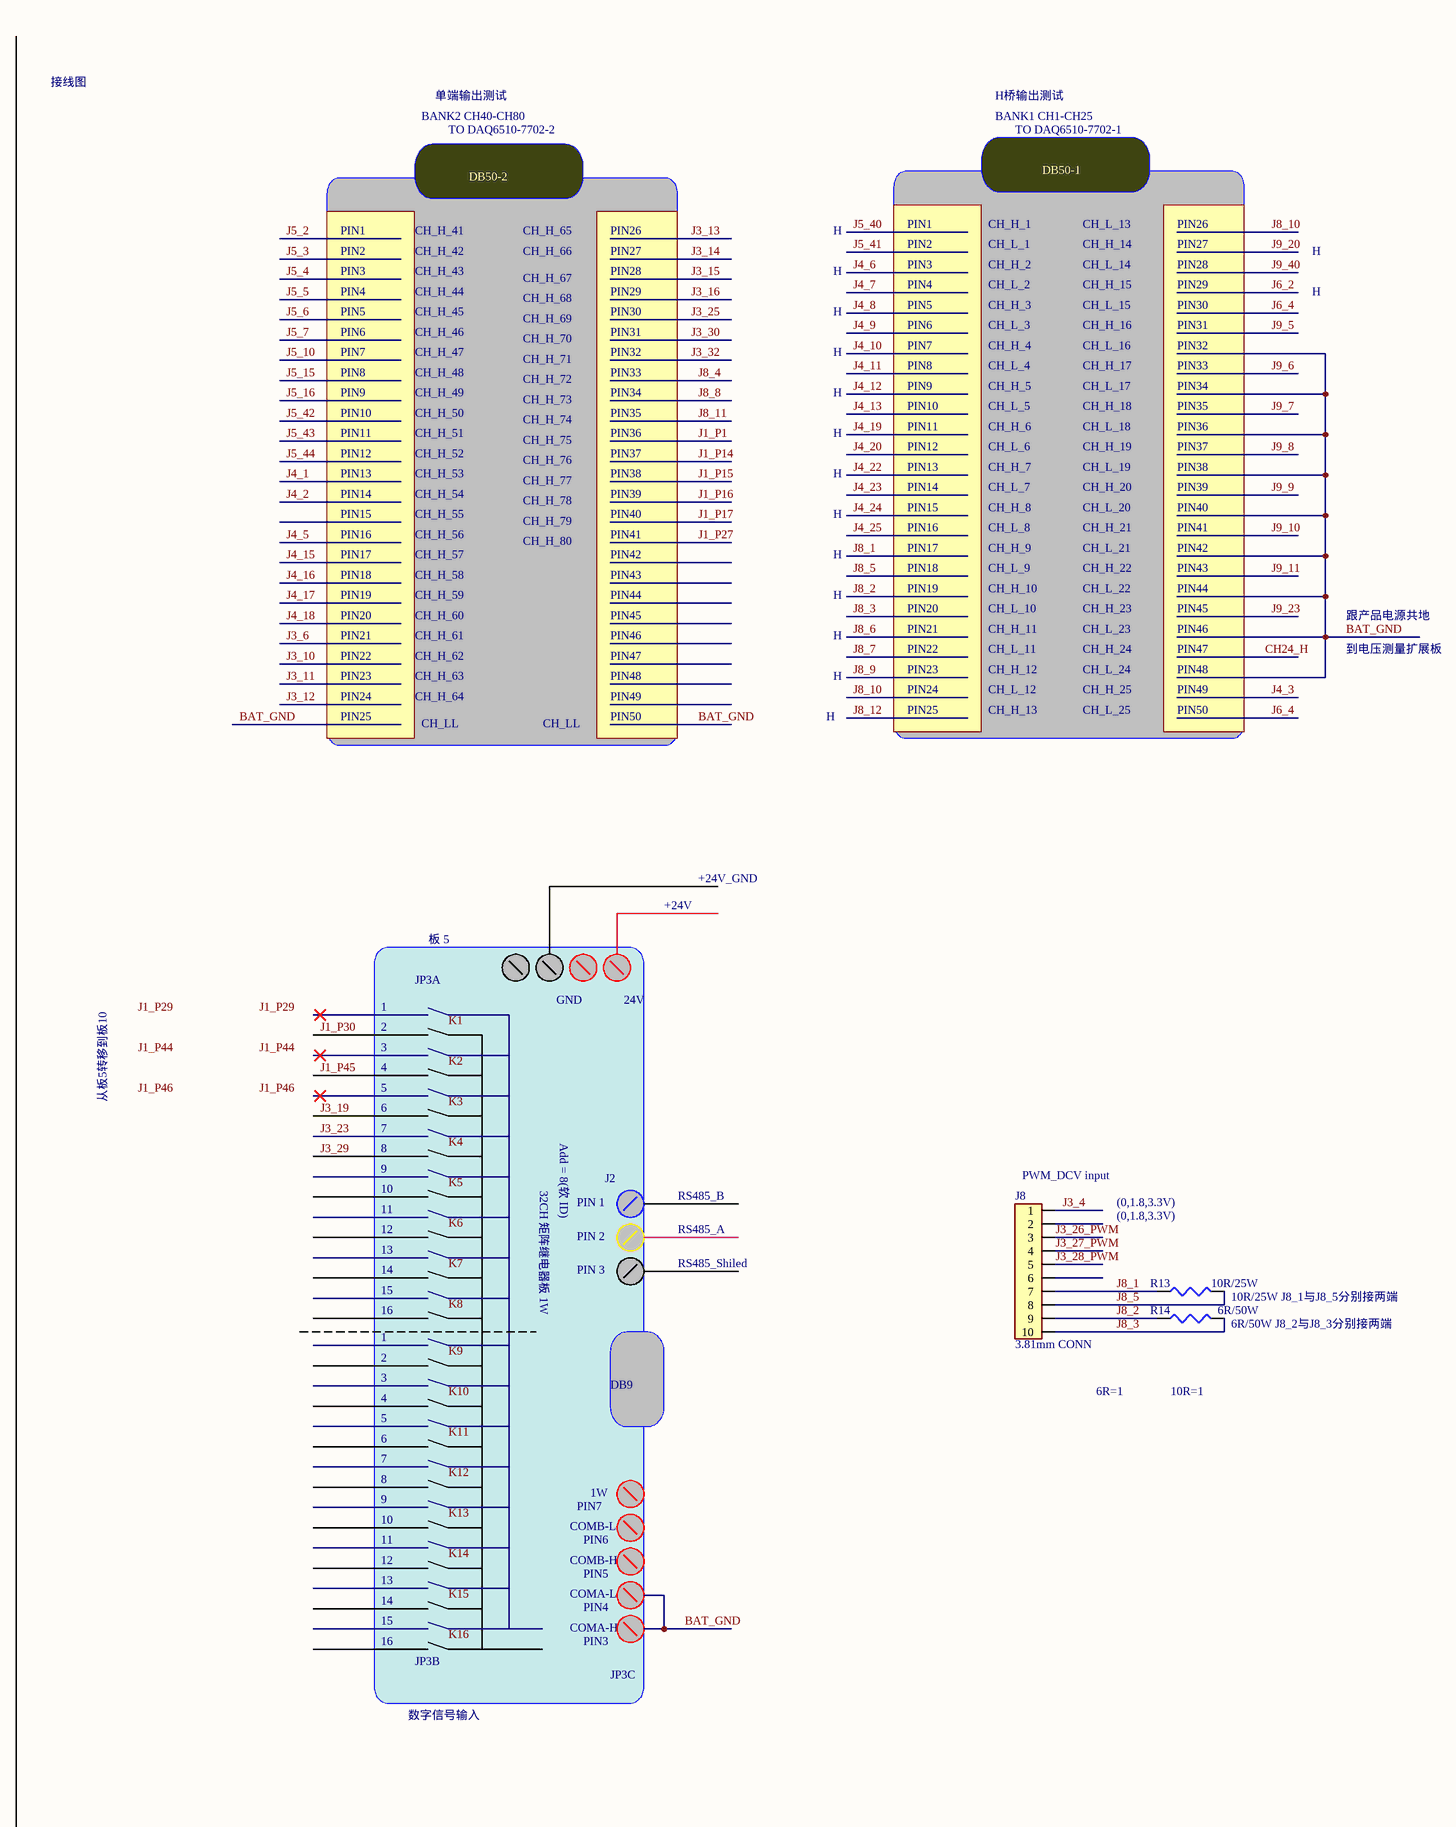
[diagram p6: 3_wiring drawing.SchDoc, right]

### Parts
(Parts that share a designator on the sheet are numbered #1, #2 ... from top to bottom, then left to right.)
J1  5.08mm  [3.81mm-2]
J1-1  T24X2  [T24X2-bend]
J1-2  T2X2  [T2X2-bend]
J3-1  T16X2  [T16X2-bend]
J3-2  3.81mm connector  [3.81mm-5-Bend]
J8#1  3.81mm CONN  [3.81mm-10]
J8#2  3.81mm CONN  [3.81mm-10]
J8-1  T7X2  [T7X2-bend]
JP4  IDC10X2  [IDC20]
JP5  T12X2  [T12X2-bend]
JP9#1  IDC15X2  [IDC30]
R13  10R/25W  [R AXIAL0.4]
R14  6R/50W  [R AXIAL0.4]
R119  1K  [AXIAL-0.25W]
R120  2.74K  [AXIAL-0.25W]
R121  2.74K  [AXIAL-0.25W]
R122  2.74K  [AXIAL-0.25W]
R123  2.74K  [AXIAL-0.25W]
R124  2.74K  [AXIAL-0.25W]
R125  2.74K  [AXIAL-0.25W]
R126  2.74K  [AXIAL-0.25W]
R127  2.74K  [AXIAL-0.25W]
R127A  2.74K  [AXIAL-0.25W]
R128  60R/10W  [立式10W]
R129  60R/10W  [立式10W]
R130  60R/10W  [立式10W]
R131  60R/10W  [立式10W]
R132  60R/10W  [立式10W]
R133  5.1K  [AXIAL-0.25W]
R134  1K  [AXIAL-0.25W]
R135  5.1K  [AXIAL-0.25W]
R136  1K  [AXIAL-0.25W]
R139  0R  [AXIAL-0.25W]
R140  0R  [AXIAL-0.25W]
R141  0R  [AXIAL-0.25W]
R142  2.74K  [AXIAL-0.25W]
R143  2.74K  [AXIAL-0.25W]
R144  2.74K  [AXIAL-0.25W]
R145  2.74K  [AXIAL-0.25W]
R146  2.74K  [AXIAL-0.25W]
R147  2.74K  [AXIAL-0.25W]
R148  2.74K  [AXIAL-0.25W]
R149  2.74K  [AXIAL-0.25W]
R150  2.74K  [AXIAL-0.25W]
R151  2.74K  [AXIAL-0.25W]

### Nets
BAT_GND: J1.2 J1-1.19 J1-1.21 J1-1.28 J1-1.38 J1-2.2 J1-2.3 J3-1.5 J3-1.17 J3-1.20 J3-1.23 J3-1.29 JP4.15 JP4.17 R119.2 R127.2 R128.2 R129.2 R131.2 R132.2  [also labelled J1_P19, J1_P21, J1_P28, J1_P38, J1_P50, J1_P51, J3_17, J3_20, J3_23, J3_29, J3_5]
BAT: J1.1 R120.2 R121.2 R122.2 R123.2 R124.2 R125.2 R126.2 R127A.2 R144.2 R145.2 R146.2 R147.2 R148.2 R149.2 R150.2 R151.2
J1_P1: J1-1.1 JP9#1.23 R144.1
J1_P2: J1-1.2 JP4.20 R145.1
J1_P5: J1-1.5 JP4.2
J1_P6: J1-1.6 JP4.4
J1_P7: J1-1.7 JP5.1
J1_P8: J1-1.8 JP5.3
J1_P9: J1-1.9 JP5.5
J1_P10: J1-1.10 JP5.7
J1_P11: J1-1.11 JP5.9
J1_P12: J1-1.12 JP5.11
J1_P13: J1-1.13 JP5.13
J1_P14: J1-1.14 JP9#1.25 R146.1
J1_P15: J1-1.15 JP9#1.27 R147.1
J1_P16: J1-1.16 JP9#1.29 R148.1
J1_P17: J1-1.17 JP9#1.26 R149.1
J1_P18: J1-1.18 JP4.6
J1_P22: J1-1.22
J1_P23: J1-1.23
J1_P24: J1-1.24 JP5.6
J1_P25: J1-1.25 JP5.8
J1_P26: J1-1.26 JP5.10
J1_P27: J1-1.27 JP9#1.28 R150.1
J1_P29: J1-1.29 JP4.1
J1_P30: J1-1.30 JP4.3
J1_P31: J1-1.31 JP5.12
J1_P32: J1-1.32 JP5.14
J1_P33: J1-1.33 JP5.16
J1_P35: J1-1.35 JP5.18
J1_P36: J1-1.36 JP5.20
J1_P37: J1-1.37 JP5.22
J1_P39: J1-1.39 JP5.24
J1_P40: J1-1.40 JP9#1.30 R151.1
J1_P41: J1-1.41 JP5.15
J1_P42: J1-1.42 JP5.17
J1_P43: J1-1.43 JP5.19
J1_P44: J1-1.44 JP4.7
J1_P45: J1-1.45 JP4.9
J1_P46: J1-1.46 JP4.11
J1_P47: J1-1.47 JP4.8
J1_P48: J1-1.48
J1_P49: J1-2.1
J1_P52: J1-2.4 JP5.21
J3_1: J3-1.1 J3-2.1
J3_3: J3-1.3 R133.1 R134.1
J3_3_2: JP4.19 R133.2
J3_3_3: JP4.12 R134.2
J3_4: J3-1.4 J8#1.1 J8#2.1
J3_6: J3-1.6 JP9#1.1 R119.1
J3_9: J3-1.9 R135.1 R136.1
J3_9_2: JP4.14 R135.2
J3_9_3: JP4.16 R136.2
J3_10: J3-1.10 JP9#1.3 R120.1
J3_11: J3-1.11 JP9#1.5 R121.1
J3_12: J3-1.12 JP9#1.7 R122.1
J3_13: J3-1.13 JP9#1.9 R123.1
J3_14: J3-1.14 JP9#1.2 R124.1
J3_15: J3-1.15 JP9#1.4 R125.1
J3_16: J3-1.16 JP9#1.6 R126.1
J3_18: J3-1.18 J3-2.2
J3_19: J3-1.19 JP4.13
J3_21: J3-1.21 J3-2.3
J3_22: J3-1.22 J3-2.4
J3_24: J3-1.24 J3-2.5
J3_25: J3-1.25 JP9#1.8 R128.1
J3_26: J3-1.26 R139.1
J3_26_PWM: J8#1.3 J8#2.3 R139.2
J3_27: J3-1.27 R140.1
J3_27_PWM: J8#1.4 J8#2.4 R140.2
J3_28: J3-1.28 R141.1
J3_28_PWM: J8#1.5 J8#2.5 R141.2
J3_30: J3-1.30 JP9#1.10 R127.1
J3_31: J3-1.31 JP4.10
J3_32: J3-1.32 JP9#1.12 R127A.1
J8_1: J8#1.7 J8#2.7 J8-1.1 JP9#1.11 R13.1
J8_2: J8#1.9 J8#2.9 J8-1.2 JP9#1.14 R14.1
J8_3: J8#1.10 J8#2.10 J8-1.3 JP9#1.13 R14.2
J8_4: J8-1.4 JP9#1.16 R129.1
J8_5: J8#1.8 J8#2.8 J8-1.5 JP9#1.15 R13.2
J8_6: J8-1.6 JP9#1.18 R130.1
J8_7: J8-1.7 JP9#1.17 R130.2
J8_8: J8-1.8 JP9#1.20 R131.1
J8_9: J8-1.9 JP9#1.19 R142.2
J8_10: J8-1.10 JP9#1.22 R142.1 R143.1
J8_11: J8-1.11 JP9#1.21 R132.1
J8_12: J8-1.12 JP9#1.24 R143.2
J8_13: J8-1.13
J8_14: J8-1.14

Not connected (* = marked no-connect by the designer): J1-1 3 4 20 34; J3-1 2 7 8; J8#1 2 6; J8#2 2 6; JP4 5 18; JP5 2 4 23

### Notes on the sheet
- J3 & J8 J1
- 接线图
- BANK2 CH40-CH80
- 单端输出测试
- TO DAQ6510-7702-2
- H桥输出测试
- BANK1 CH1-CH25
- TO DAQ6510-7702-1
- DB50-2
- DB50-1
- PIN1
- PIN2
- CH_H_41
- CH_H_42
- CH_H_65
- CH_H_66
- PIN26
- PIN27
- H
- PIN3
- CH_H_1
- CH_H_2
- CH_L_1
- CH_H_14
- CH_L_13
- CH_L_14
- PIN28
- 新增J1-P38 TO GND
- PIN4
- PIN5
- CH_H_43
- CH_H_44
- CH_H_45
- CH_H_67
- CH_H_68
- CH_H_69
- PIN29
- PIN30
- PIN6
- CH_H_3
- CH_L_2
- CH_L_3
- CH_H_15
- CH_H_16
- CH_L_15
- PIN31
- PIN7
- PIN8
- PIN9
- CH_H_46
- CH_H_47
- CH_H_48
- CH_H_49
- CH_H_70
- CH_H_71
- CH_H_72
- CH_H_73
- PIN32
- PIN33
- PIN34
- CH_H_4
- CH_H_5
- CH_L_4
- CH_H_17
- CH_L_16
- CH_L_17
- J3 连接器有以上网络悬空
- PIN10
- PIN11
- PIN12
- CH_H_50
- CH_H_51
- CH_H_52
- CH_H_74
- CH_H_75
- CH_H_76
- PIN35
- PIN36
- PIN37
- CH_H_6
- CH_L_5
- CH_L_6
- CH_H_18
- CH_H_19
- CH_L_18
- 修正R119 值
- PWM OUTPUT
- PIN13
- PIN14
- PIN15
- PIN16
- CH_H_53
- CH_H_54
- CH_H_55
- CH_H_56
- CH_H_77
- CH_H_78
- CH_H_79
- PIN38
- PIN39
- PIN40
- PIN41
- CH_H_7
- CH_H_8
- CH_L_7
- CH_L_8
- CH_H_20
- CH_H_21
- CH_L_19
- CH_L_20
- J1 连接器有以上网络悬空
- 新增
- PIN17
- PIN18
- PIN19
- CH_H_57
- CH_H_58
- CH_H_59
- CH_H_80
- PIN42
- PIN43
- PIN44
- CH_H_9
- CH_H_10
- CH_L_9
- CH_H_22
- CH_L_21
- CH_L_22
- PIN20
- PIN21
- PIN22
- CH_H_60
- CH_H_61
- CH_H_62
- PIN45
- PIN46
- PIN47
- PIN23
- CH_H_11
- CH_H_12
- CH_L_10
- CH_L_11
- CH_H_23
- CH_H_24
- CH_L_23
- CH_L_24
- PIN48
- 跟产品电源共地
- 到电压测量扩展板
- (near J1) BAT
- J1-27 PWM OUTPUT
- PIN24
- PIN25
- CH_H_63
- CH_H_64
- CH_LL
- PIN49
- PIN50
- CH_H_13
- CH_L_12
- CH_H_25
- CH_L_25
- (near R127A) 新增
- (near JP9#1) TO DMM
- TO BAT OR NONE
- TO GND OR NONE
- 变更网络
- 板 5
- +24V
- +24V_GND
- JP3A
- GND
- 24V
- (near R143) 输出
- (near JP4) TO SWITCH BOARD
- 1
- 2
- 3
- 4
- (near J8#1) PWM_DCV input
- (0,1.8,3.3V)
- 从板5转移到板10
- 5
- 6
- 7
- Add = 8(软 ID)
- 8
- 9
- 10
- 11
- 32CH 矩阵继电器板 1W
- PIN 1
- J2
- RS485_B
- (near J8#2) PWM_DCV input
- 10R/25W J8_1与J8_5分别接两端
- 6R/50W J8_2与J8_3分别接两端
- 12
- 13
- 14
- PIN 2
- PIN 3
- RS485_A
- RS485_Shiled
- (near R141) 输入
- 15
- 16
- DB9
- 6R=1
- 10R=1
- COMB-L
- 1W
- (near R151) PWM BY DMM OR DAQ
- (near JP5) 备用 立式
- COMB-H
- COMA-L
- JP3B
- COMA-H
- JP3C
- (near J3-2) 新增-备用
- 数字信号输入
- Labels drawn without touching a wire or pin: ECANH, ECANL, J1_P3, J1_P4, J1_P20, J1_P29, J1_P30, J1_P34, J1_P38, J1_P44, J1_P45, J1_P46, J3_2_LIN1, J3_7_CCANH, J3_8_CCANL, J3_17, J3_19, J3_23, J3_29, K1, K2, K3, K4, K5, K6, K7, K8, K9, K10, K11, K12, K13, K14, K15, K16
- Document Number:
- Rev:
- Project Name:
- Drawn By:
- Date:
- Titile:
- Checked By:
- Sheet:
- Of

### Library data of the parts
J1 = CON2-3.81
J3-2 = CON5-3.81
J8#1 J8#2 = CON10-3.81
J8-1 = IDC7X2
R13 R14 = RES2
R119-R127 R127A R128-R136 R139-R151 = RES1

## Sheet 4_wiring drawing.SchDoc: Shaking control system
size A2; ApprovedBy: Approved By; CheckedBy: Sky Ma; DrawnBy: Jack; Address1: 1; Address2: 2; Address3: 3; Address4: 4; DocumentNumber: 04-TE-42-4015-0PA-A; Revision: A; SheetNumber: 5; SheetTotal: 6; SheetSize: A2; CheckedByDate: 2022-12-5; DrawByDate: 2022-12-5; SiteName: EMS TD Huangpu; ProjectName: 19205_BMW CCU DDR PCBA FT fixture wiring
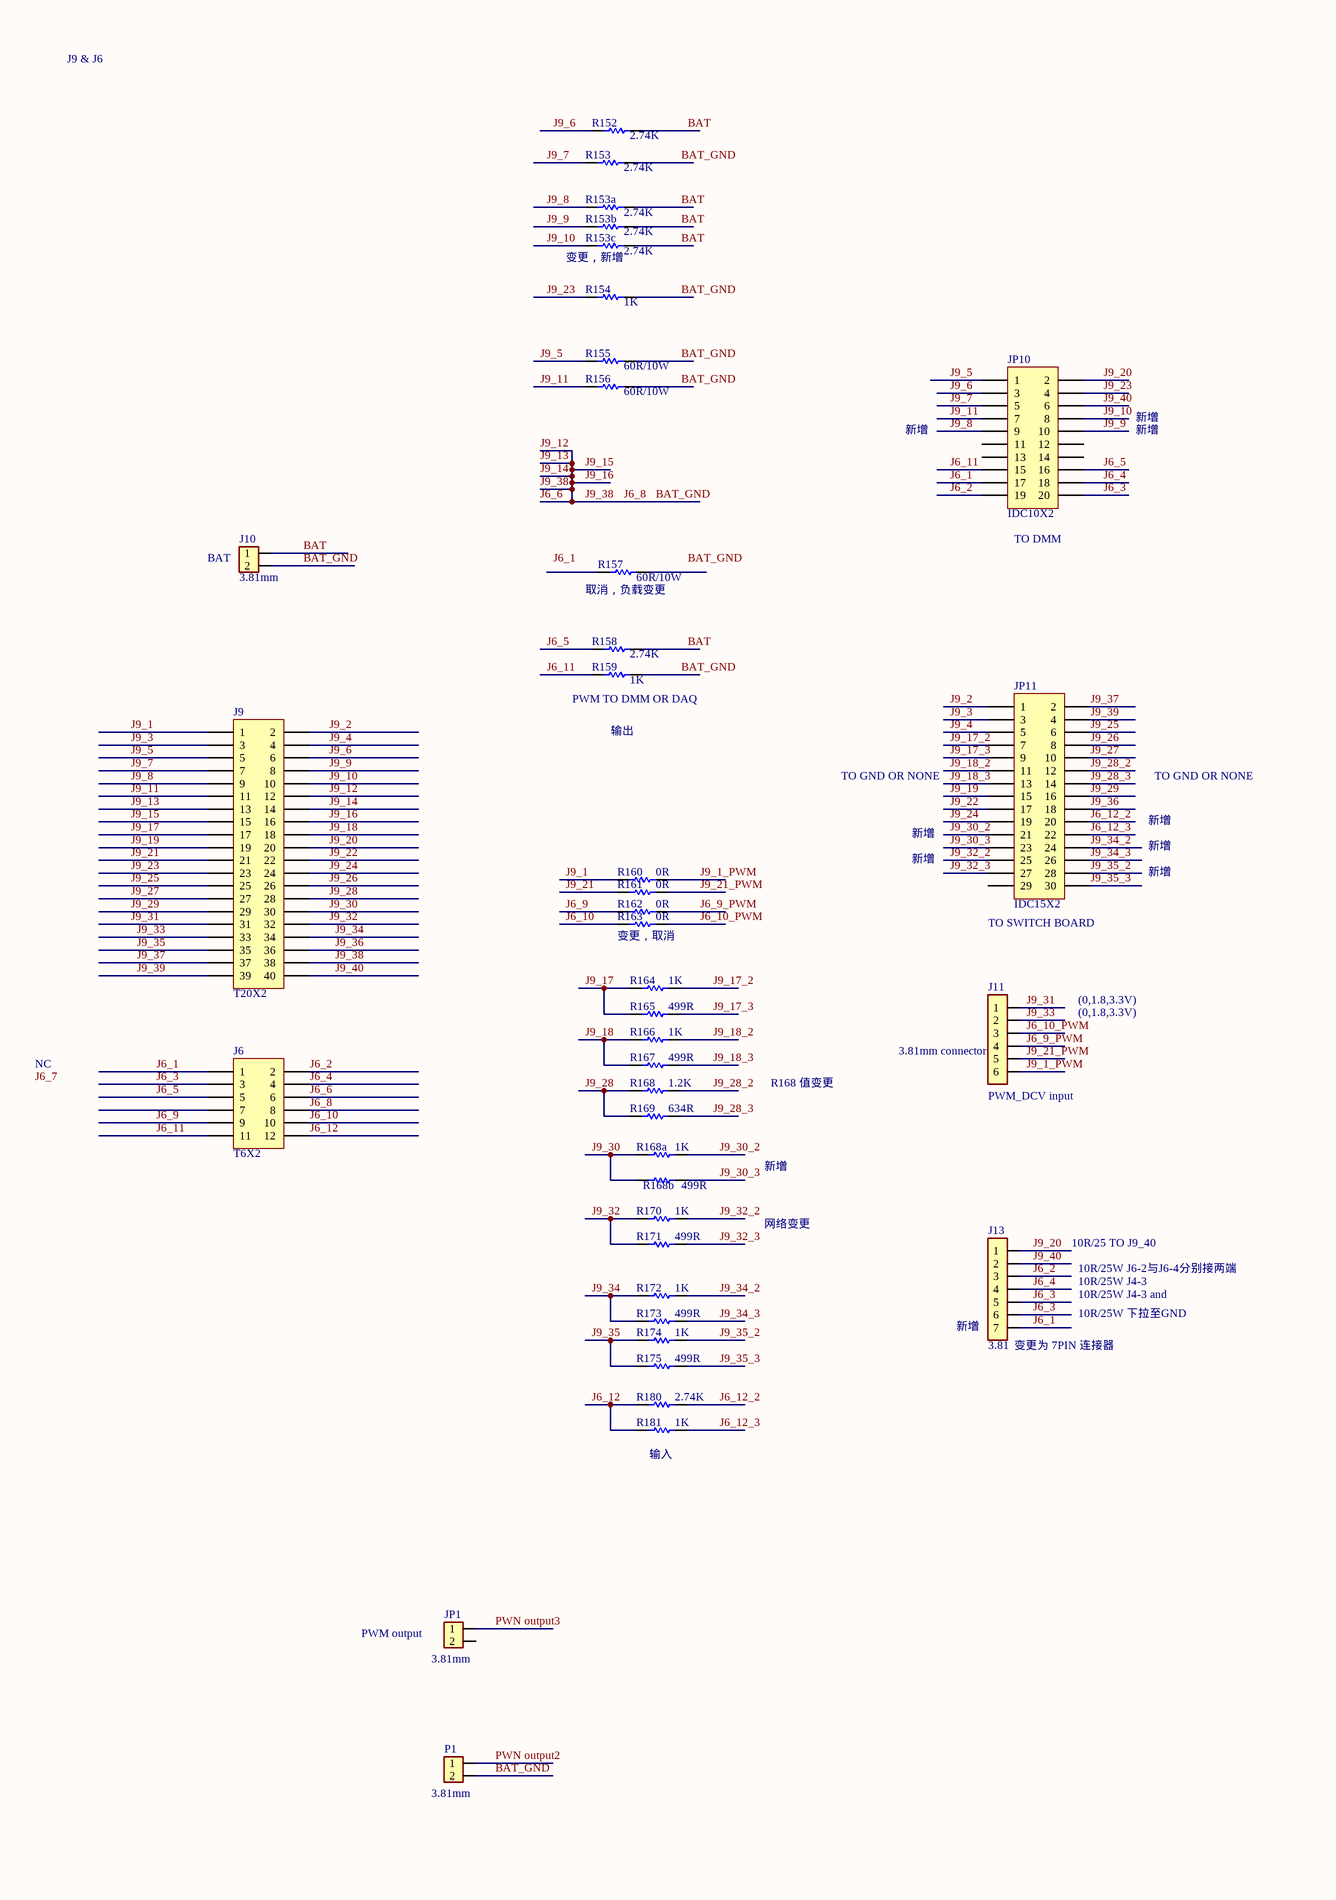
[diagram p7: 4_wiring drawing.SchDoc, left]
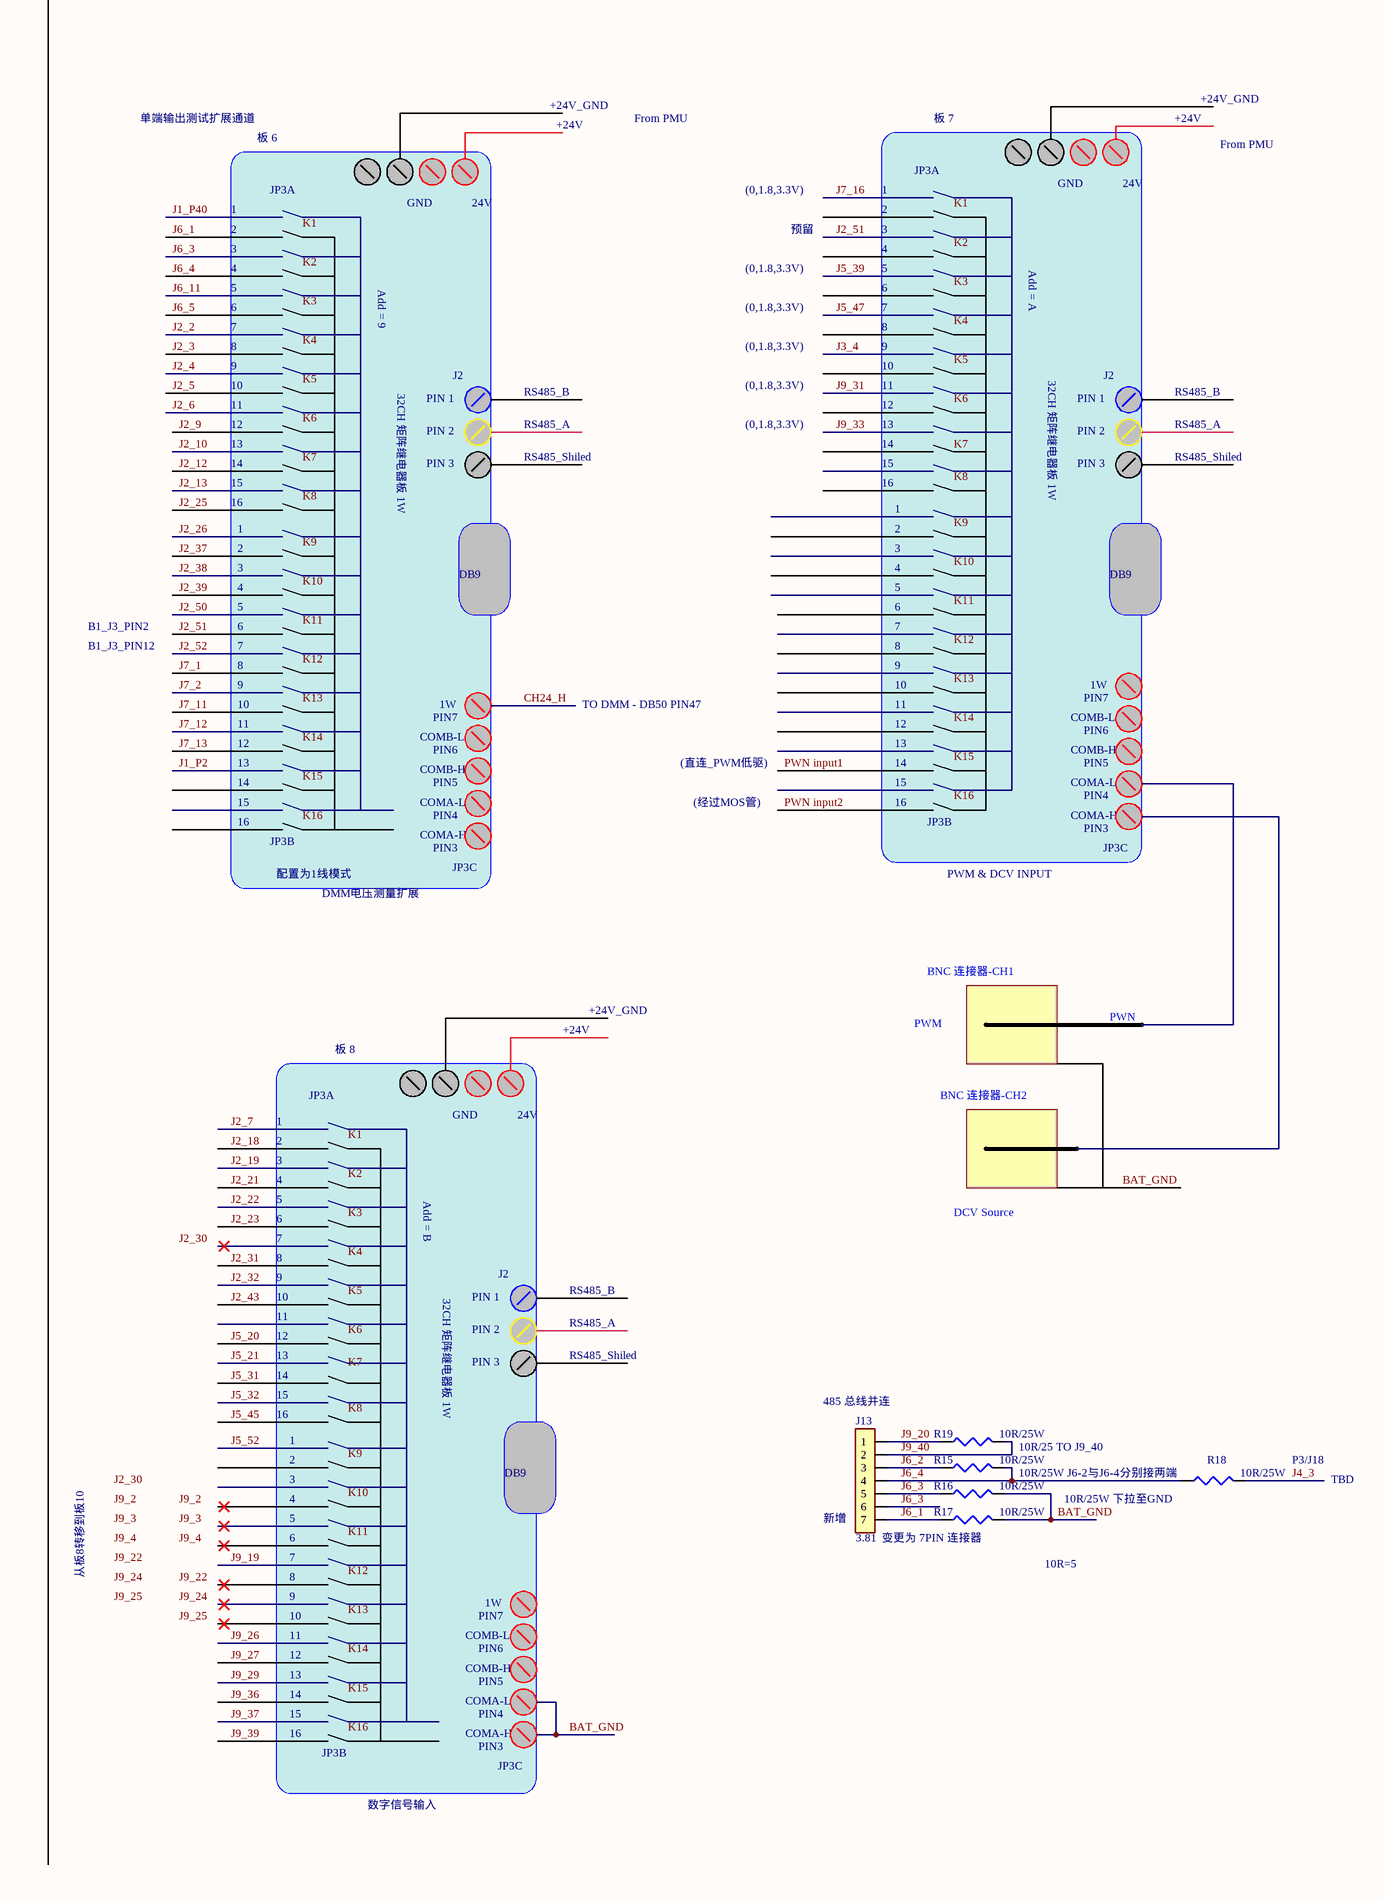
[diagram p8: 4_wiring drawing.SchDoc, right]

### Parts
(Parts that share a designator on the sheet are numbered #1, #2 ... from top to bottom, then left to right.)
J6  T6X2  [T6X2-bend]
J9  T20X2  [T20X2-bend]
J10  3.81mm  [3.81mm-2]
J11  3.81mm connector  [3.81mm-6]
J13#1  3.81  [3.96mm-7]
J13#2  3.81  [3.96mm-7]
JP1#2  3.81mm  [3.81mm-2]
JP10#1  IDC10X2  [IDC20]
JP11  IDC15X2  [IDC30]
P1#1  3.81mm  [3.81mm-2]
R15  10R/25W  [R AXIAL0.4]
R16  10R/25W  [R AXIAL0.4]
R17  10R/25W  [R AXIAL0.4]
R18  10R/25W  [R AXIAL0.4]
R19#2  10R/25W  [R AXIAL0.4]
R152  2.74K  [AXIAL-0.25W]
R153  2.74K  [AXIAL-0.25W]
R153a  2.74K  [AXIAL-0.25W]
R153b  2.74K  [AXIAL-0.25W]
R153c  2.74K  [AXIAL-0.25W]
R154  1K  [AXIAL-0.25W]
R155  60R/10W  [立式10W]
R156  60R/10W  [立式10W]
R157  60R/10W  [立式10W]
R158  2.74K  [AXIAL-0.25W]
R159  1K  [AXIAL-0.25W]
R160  0R  [AXIAL-0.25W]
R161  0R  [AXIAL-0.25W]
R162  0R  [AXIAL-0.25W]
R163  0R  [AXIAL-0.25W]
R164  1K  [AXIAL-0.25W]
R165  499R  [AXIAL-0.25W]
R166  1K  [AXIAL-0.25W]
R167  499R  [AXIAL-0.25W]
R168  1.2K  [AXIAL-0.25W]
R168a  1K  [AXIAL-0.25W]
R168b  499R  [AXIAL-0.25W]
R169  634R  [AXIAL-0.25W]
R170  1K  [AXIAL-0.25W]
R171  499R  [AXIAL-0.25W]
R172  1K  [AXIAL-0.25W]
R173  499R  [AXIAL-0.25W]
R174  1K  [AXIAL-0.25W]
R175  499R  [AXIAL-0.25W]
R180  2.74K  [AXIAL-0.25W]
R181  1K  [AXIAL-0.25W]

### Nets
BAT_GND: J6.6 J6.8 J9.12 J9.13 J9.14 J9.15 J9.16 J9.38 J10.2 P1#1.2 R16.2 R17.2 R153.2 R154.2 R155.2 R156.2 R159.2  [also labelled J6_6, J6_8, J9_12, J9_13, J9_14, J9_15, J9_16, J9_38]
BAT: J10.1 R152.2 R153a.2 R153b.2 R153c.2 R158.2
J4_3: R18.2
J6_1: J6.1 J13#1.7 J13#2.7 JP10#1.17 R17.1
J6_2: J6.2 J13#1.3 J13#2.3 JP10#1.19 R15.1
J6_3: J6.3 J13#1.5 J13#1.6 J13#2.5 J13#2.6 JP10#1.20 R16.1
J6_4: J6.4 J13#1.4 J13#2.4 JP10#1.18 R15.2 R18.1
J6_5: J6.5 JP10#1.16 R158.1
J6_9: J6.9 R162.1
J6_9_PWM: J11.4 R162.2
J6_10: J6.10 R163.1
J6_10_PWM: J11.3 R163.2
J6_11: J6.11 JP10#1.15 R159.1
J6_12: J6.12 R180.1 R181.1
J6_12_2: JP11.20 R180.2
J6_12_3: JP11.22 R181.2
J9_1: J9.1 R160.1
J9_1_PWM: J11.6 R160.2
J9_2: J9.2 JP11.1
J9_3: J9.3 JP11.3
J9_4: J9.4 JP11.5
J9_5: J9.5 JP10#1.1 R155.1
J9_6: J9.6 JP10#1.3 R152.1
J9_7: J9.7 JP10#1.5 R153.1
J9_8: J9.9 JP10#1.9 R153a.1
J9_9: J9.8 JP10#1.10 R153b.1
J9_10: J9.10 JP10#1.8 R153c.1
J9_11: J9.11 JP10#1.7 R156.1
J9_17: J9.17 R164.1 R165.1
J9_17_2: JP11.7 R164.2
J9_17_3: JP11.9 R165.2
J9_18: J9.18 R166.1 R167.1
J9_18_2: JP11.11 R166.2
J9_18_3: JP11.13 R167.2
J9_19: J9.19 JP11.15
J9_20: J9.20 J13#1.1 J13#2.1 JP10#1.2 R19#2.1
J9_21: J9.21 R161.1
J9_21_PWM: J11.5 R161.2
J9_22: J9.22 JP11.17
J9_23: J9.23 JP10#1.4 R154.1
J9_24: J9.24 JP11.19
J9_25: J9.25 JP11.6
J9_26: J9.26 JP11.8
J9_27: J9.27 JP11.10
J9_28: J9.28 R168.1 R169.1
J9_28_2: JP11.12 R168.2
J9_28_3: JP11.14 R169.2
J9_29: J9.29 JP11.16
J9_30: J9.30 R168a.1 R168b.1
J9_30_2: JP11.21 R168a.2
J9_30_3: JP11.23 R168b.2
J9_31: J9.31 J11.1
J9_32: J9.32 R170.1 R171.1
J9_32_2: JP11.25 R170.2
J9_32_3: JP11.27 R171.2
J9_33: J9.33 J11.2
J9_34: J9.34 R172.1 R173.1
J9_34_2: JP11.24 R172.2
J9_34_3: JP11.26 R173.2
J9_35: J9.35 R174.1 R175.1
J9_35_2: JP11.28 R174.2
J9_35_3: JP11.30 R175.2
J9_36: J9.36 JP11.18
J9_37: J9.37 JP11.2
J9_39: J9.39 JP11.4
J9_40: J9.40 J13#1.2 J13#2.2 JP10#1.6 R19#2.2
PWN output2: P1#1.1
PWN output3: JP1#2.1

Not connected (* = marked no-connect by the designer): J6 7; JP1#2 2; JP10#1 11 12 13 14; JP11 29; R157 1 2

### Notes on the sheet
- J9 & J6
- 单端输出测试扩展通道
- 板 6
- +24V_GND
- +24V
- From PMU
- 板 7
- (near R153c) 变更，新增
- JP3A
- (0,1.8,3.3V)
- 1
- GND
- 24V
- 2
- 3
- 4
- 预留
- 5
- Add = A
- 新增
- 6
- 7
- Add = 9
- 8
- 9
- 10
- 32CH 矩阵继电器板 1W
- PIN 1
- J2
- RS485_B
- 11
- (near JP10#1) TO DMM
- 12
- 13
- PIN 2
- RS485_A
- RS485_Shiled
- 14
- (near J10) BAT
- (near R157) 取消，负载变更
- 15
- 16
- PIN 3
- DB9
- (near R159) PWM TO DMM OR DAQ
- 输出
- B1_J3_PIN2
- B1_J3_PIN12
- TO GND OR NONE
- PIN7
- 1W
- TO DMM - DB50 PIN47
- COMB-L
- COMB-H
- PIN5
- PIN6
- (直连_PWM低驱)
- COMA-L
- (near JP11) TO SWITCH BOARD
- JP3B
- COMA-H
- PIN3
- PIN4
- (经过MOS管)
- JP3C
- (near R163) 变更，取消
- 配置为1线模式
- DMM电压测量扩展
- PWM & DCV INPUT
- BNC 连接器-CH1
- NC
- R168 值变更
- (near J11) PWM_DCV input
- 板 8
- PWM
- PWN
- BNC 连接器-CH2
- 网络变更
- 10R/25 TO J9_40
- 10R/25W J6-2与J6-4分别接两端
- 10R/25W J4-3
- 10R/25W J4-3 and
- 10R/25W 下拉至GND
- Add = B
- DCV Source
- (near J13#1) 新增
- (near J13#1) 变更为 7PIN 连接器
- (near R181) 输入
- (near J13#2) 485 总线并连
- P3/J18
- TBD
- (near JP1#2) PWM output
- 从板8转移到板10
- (near J13#2) 新增
- 变更为 7PIN 连接器
- 10R=5
- 数字信号输入
- Labels drawn without touching a wire or pin: BAT_GND, J1_P2, J1_P40, J2_2, J2_3, J2_4, J2_5, J2_6, J2_7, J2_9, J2_10, J2_12, J2_13, J2_18, J2_19, J2_21, J2_22, J2_23, J2_25, J2_26, J2_30, J2_31, J2_32, J2_37, J2_38, J2_39, J2_43, J2_50, J2_51, J2_52, J3_4, J5_20, J5_21, J5_31, J5_32, J5_39, J5_45, J5_47, J5_52, J6_1, J6_3, J6_4, J6_5, J6_7, J6_11, J7_1, J7_2, J7_11, J7_12, J7_13, J7_16, J9_2, J9_3, J9_4, J9_19, J9_22, J9_24, J9_25, J9_26, J9_27, J9_29, J9_31, J9_33, J9_36, J9_37, J9_39, K1, K2, K3, K4, K5, K6, K7, K8, K9, K10, K11, K12, K13, K14, K15, K16, PWN input1, PWN input2
- Document Number:
- Rev:
- Project Name:
- Drawn By:
- Date:
- Titile:
- Checked By:
- Sheet:
- Of

### Library data of the parts
J9 = IDC20X2
J10 JP1#2 P1#1 = CON2-3.81
J11 = CON6-3.81
J13#1 J13#2 = CON7-3.96
R15-R18 R19#2 = RES2
R152 R153 R153a R153b R153c R154-R168 R168a R168b R169-R175 R180 R181 = RES1

## Sheet 5_wiring drawing.SchDoc: PMU
size A2; ApprovedBy: Approved By; CheckedBy: Sky Ma; DrawnBy: Jack; Address1: 1; Address2: 2; Address3: 3; Address4: 4; DocumentNumber: 04-TE-42-4015-0PA-A; Revision: A; SheetNumber: 6; SheetTotal: 6; SheetSize: A2; CheckedByDate: 2022-12-5; DrawByDate: 2022-12-5; SiteName: EMS TD Huangpu; ProjectName: 19205_BMW CCU DDR PCBA FT fixture wiring
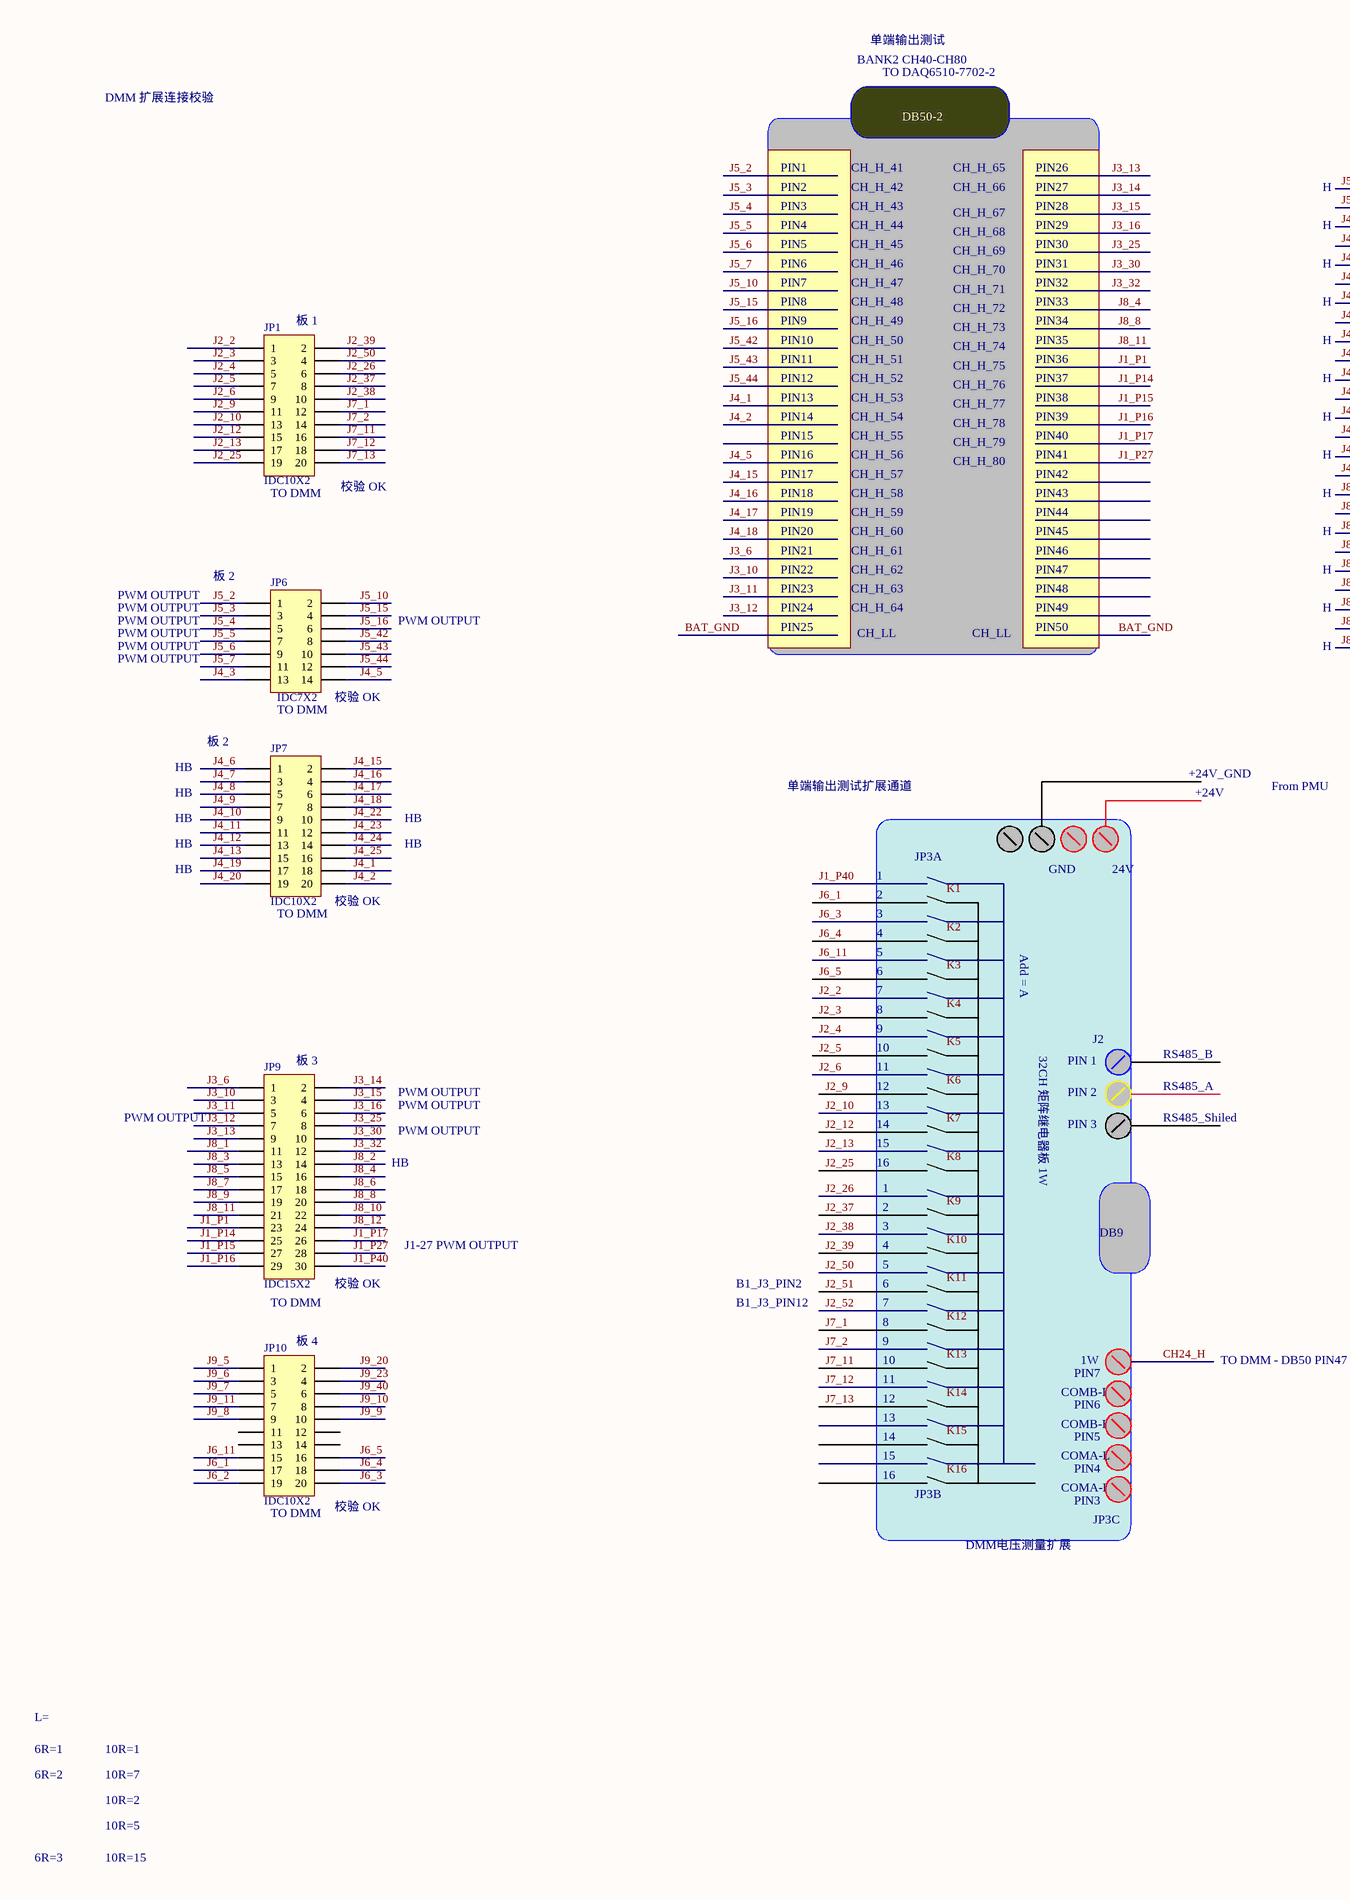
[diagram p9: 5_wiring drawing.SchDoc, left]
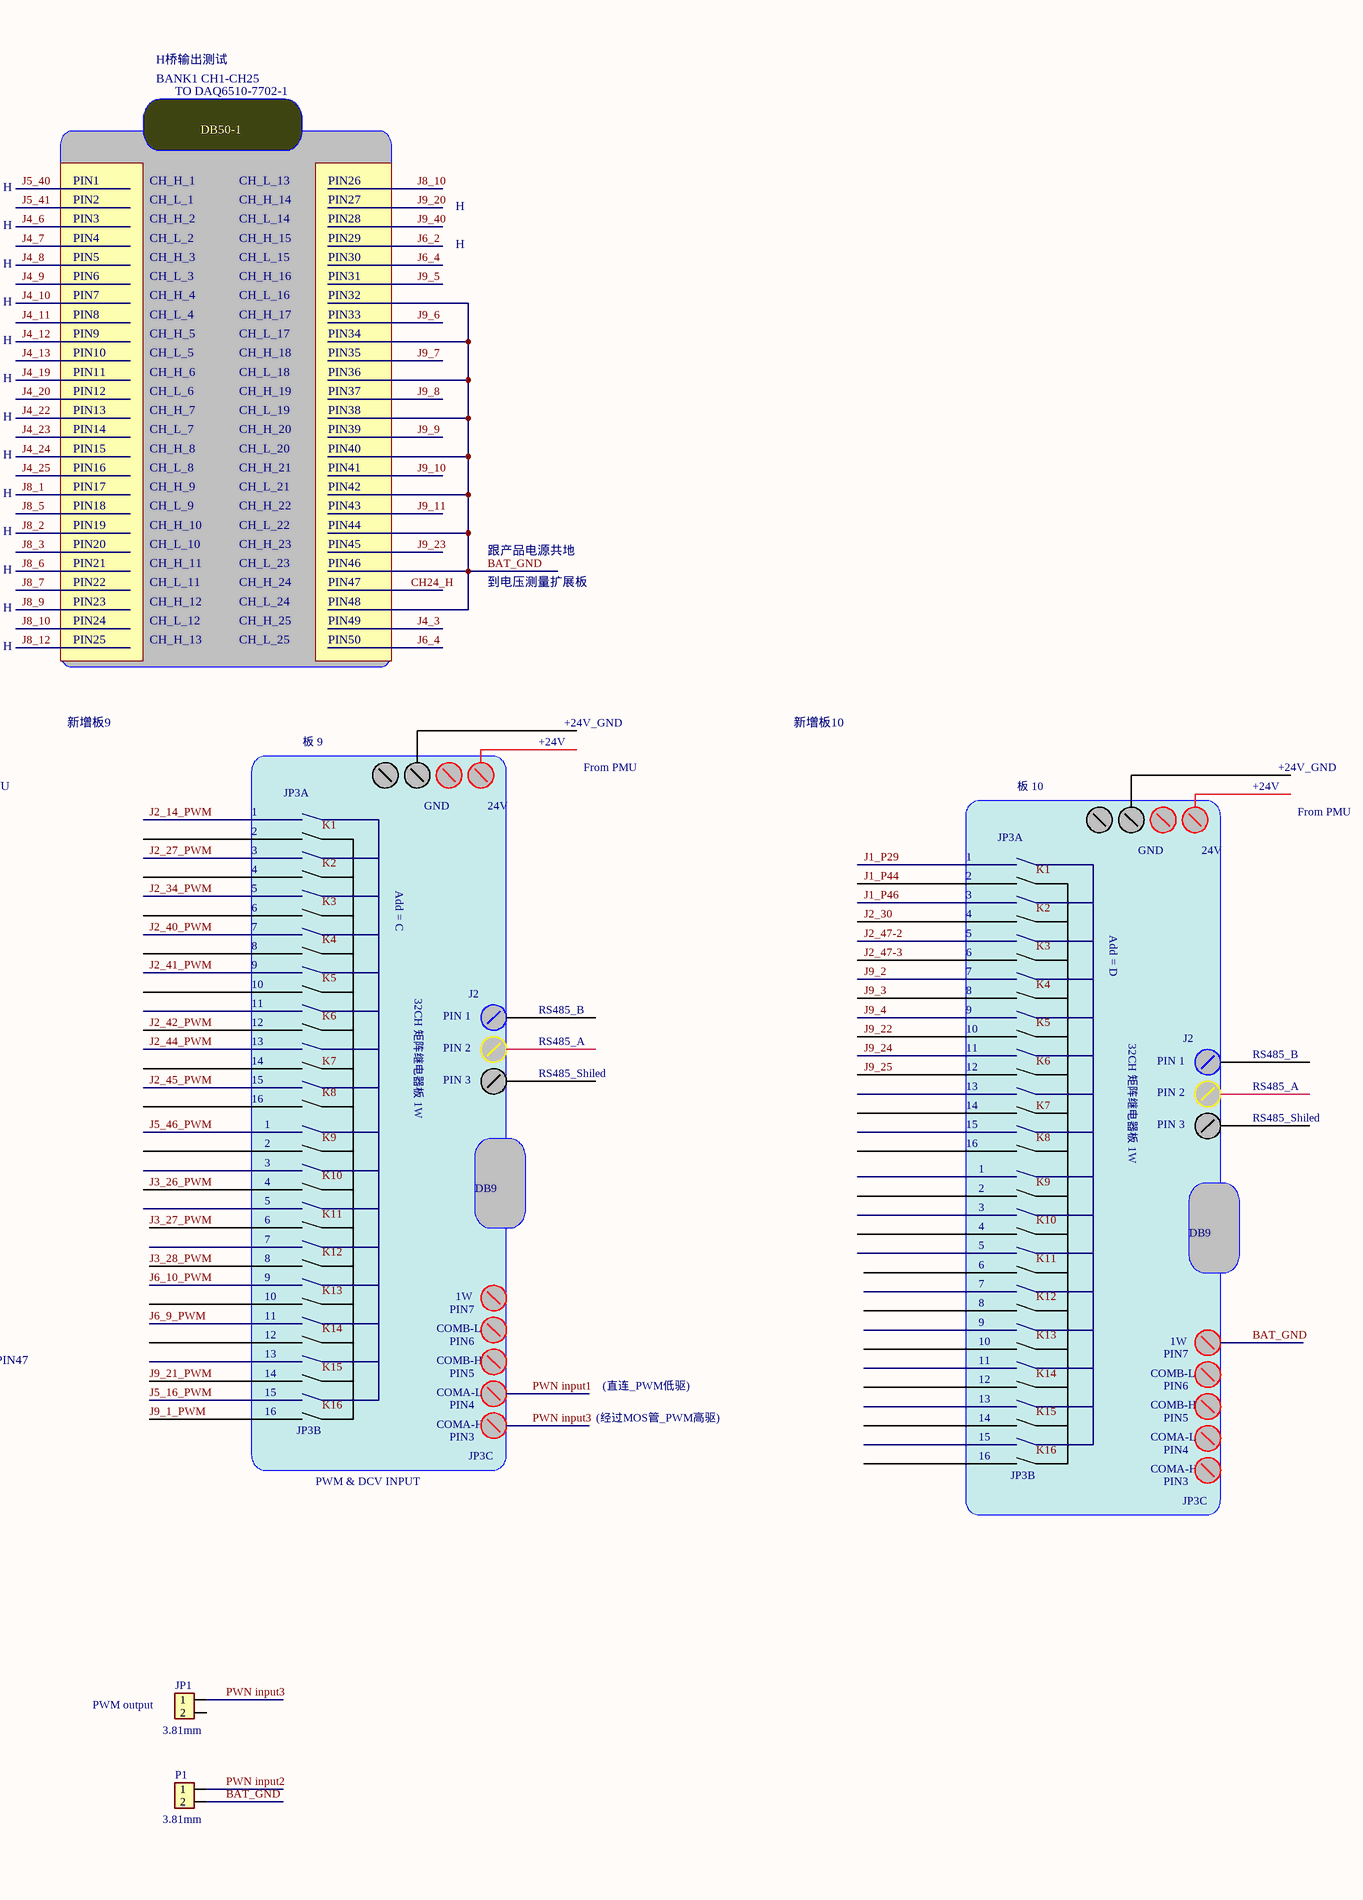
[diagram p10: 5_wiring drawing.SchDoc, right]

### Parts
(Parts that share a designator on the sheet are numbered #1, #2 ... from top to bottom, then left to right.)
JP1#3  IDC10X2  [IDC20]
JP1#4  3.81mm  [3.81mm-2]
JP6#2  IDC7X2  [IDC14]
JP7#2  IDC10X2  [IDC20]
JP9#2  IDC15X2  [IDC30]
JP10#2  IDC10X2  [IDC20]
P1#2  3.81mm  [3.81mm-2]

### Nets
BAT_GND: P1#2.2
J1_P1: JP9#2.23
J1_P14: JP9#2.25
J1_P15: JP9#2.27
J1_P16: JP9#2.29
J1_P17: JP9#2.26
J1_P27: JP9#2.28
J1_P40: JP9#2.30
J2_2: JP1#3.1
J2_3: JP1#3.3
J2_4: JP1#3.5
J2_5: JP1#3.7
J2_6: JP1#3.9
J2_9: JP1#3.11
J2_10: JP1#3.13
J2_12: JP1#3.15
J2_13: JP1#3.17
J2_25: JP1#3.19
J2_26: JP1#3.6
J2_37: JP1#3.8
J2_38: JP1#3.10
J2_39: JP1#3.2
J2_50: JP1#3.4
J3_6: JP9#2.1
J3_10: JP9#2.3
J3_11: JP9#2.5
J3_12: JP9#2.7
J3_13: JP9#2.9
J3_14: JP9#2.2
J3_15: JP9#2.4
J3_16: JP9#2.6
J3_25: JP9#2.8
J3_30: JP9#2.10
J3_32: JP9#2.12
J4_1: JP7#2.18
J4_2: JP7#2.20
J4_3: JP6#2.13
J4_5: JP6#2.14
J4_6: JP7#2.1
J4_7: JP7#2.3
J4_8: JP7#2.5
J4_9: JP7#2.7
J4_10: JP7#2.9
J4_11: JP7#2.11
J4_12: JP7#2.13
J4_13: JP7#2.15
J4_15: JP7#2.2
J4_16: JP7#2.4
J4_17: JP7#2.6
J4_18: JP7#2.8
J4_19: JP7#2.17
J4_20: JP7#2.19
J4_22: JP7#2.10
J4_23: JP7#2.12
J4_24: JP7#2.14
J4_25: JP7#2.16
J5_2: JP6#2.1
J5_3: JP6#2.3
J5_4: JP6#2.5
J5_5: JP6#2.7
J5_6: JP6#2.9
J5_7: JP6#2.11
J5_10: JP6#2.2
J5_15: JP6#2.4
J5_16: JP6#2.6
J5_42: JP6#2.8
J5_43: JP6#2.10
J5_44: JP6#2.12
J6_1: JP10#2.17
J6_2: JP10#2.19
J6_3: JP10#2.20
J6_4: JP10#2.18
J6_5: JP10#2.16
J6_11: JP10#2.15
J7_1: JP1#3.12
J7_2: JP1#3.14
J7_11: JP1#3.16
J7_12: JP1#3.18
J7_13: JP1#3.20
J8_1: JP9#2.11
J8_2: JP9#2.14
J8_3: JP9#2.13
J8_4: JP9#2.16
J8_5: JP9#2.15
J8_6: JP9#2.18
J8_7: JP9#2.17
J8_8: JP9#2.20
J8_9: JP9#2.19
J8_10: JP9#2.22
J8_11: JP9#2.21
J8_12: JP9#2.24
J9_5: JP10#2.1
J9_6: JP10#2.3
J9_7: JP10#2.5
J9_8: JP10#2.9
J9_9: JP10#2.10
J9_10: JP10#2.8
J9_11: JP10#2.7
J9_20: JP10#2.2
J9_23: JP10#2.4
J9_40: JP10#2.6
PWN input2: P1#2.1
PWN input3: JP1#4.1

Not connected (* = marked no-connect by the designer): JP1#4 2; JP10#2 11 12 13 14

### Notes on the sheet
- BANK2 CH40-CH80
- 单端输出测试
- TO DAQ6510-7702-2
- H桥输出测试
- BANK1 CH1-CH25
- TO DAQ6510-7702-1
- DMM 扩展连接校验
- DB50-2
- DB50-1
- PIN1
- PIN2
- PIN3
- CH_H_41
- CH_H_42
- CH_H_43
- CH_H_65
- CH_H_66
- CH_H_67
- PIN26
- PIN27
- PIN28
- H
- CH_H_1
- CH_H_2
- CH_L_1
- CH_H_14
- CH_L_13
- CH_L_14
- PIN4
- PIN5
- PIN6
- CH_H_44
- CH_H_45
- CH_H_46
- CH_H_68
- CH_H_69
- CH_H_70
- PIN29
- PIN30
- PIN31
- CH_H_3
- CH_L_2
- CH_L_3
- CH_H_15
- CH_H_16
- CH_L_15
- (near JP1#3) 板 1
- PIN7
- PIN8
- PIN9
- PIN10
- CH_H_47
- CH_H_48
- CH_H_49
- CH_H_50
- CH_H_71
- CH_H_72
- CH_H_73
- CH_H_74
- PIN32
- PIN33
- PIN34
- PIN35
- CH_H_4
- CH_H_5
- CH_L_4
- CH_H_17
- CH_L_16
- CH_L_17
- PIN11
- PIN12
- PIN13
- CH_H_51
- CH_H_52
- CH_H_53
- CH_H_75
- CH_H_76
- CH_H_77
- PIN36
- PIN37
- PIN38
- CH_H_6
- CH_L_5
- CH_L_6
- CH_H_18
- CH_H_19
- CH_L_18
- PIN14
- PIN15
- PIN16
- PIN17
- CH_H_54
- CH_H_55
- CH_H_56
- CH_H_57
- CH_H_78
- CH_H_79
- CH_H_80
- PIN39
- PIN40
- PIN41
- PIN42
- CH_H_7
- CH_H_8
- CH_L_7
- CH_L_8
- CH_H_20
- CH_H_21
- CH_L_19
- CH_L_20
- (near JP1#3) TO DMM
- (near JP1#3) 校验 OK
- PIN18
- PIN19
- PIN20
- CH_H_58
- CH_H_59
- CH_H_60
- PIN43
- PIN44
- PIN45
- CH_H_9
- CH_H_10
- CH_L_9
- CH_H_22
- CH_L_21
- CH_L_22
- PWM OUTPUT
- (near JP6#2) 板 2
- PIN21
- PIN22
- PIN23
- CH_H_61
- CH_H_62
- CH_H_63
- PIN46
- PIN47
- PIN48
- CH_H_11
- CH_H_12
- CH_L_10
- CH_L_11
- CH_H_23
- CH_H_24
- CH_L_23
- CH_L_24
- 跟产品电源共地
- 到电压测量扩展板
- PIN24
- PIN25
- CH_H_64
- CH_LL
- PIN49
- PIN50
- CH_H_13
- CH_L_12
- CH_H_25
- CH_L_25
- (near JP6#2) TO DMM
- (near JP6#2) 校验 OK
- 新增板9
- +24V_GND
- 新增板10
- HB
- 板 2
- 单端输出测试扩展通道
- From PMU
- 板 9
- +24V
- 板 10
- JP3A
- 1
- 2
- 3
- GND
- 24V
- (near JP7#2) TO DMM
- (near JP7#2) 校验 OK
- 4
- 5
- 6
- Add = C
- Add = A
- 7
- 8
- 9
- 10
- J2
- Add = D
- 11
- 12
- 13
- 32CH 矩阵继电器板 1W
- PIN 1
- RS485_B
- RS485_A
- (near JP9#2) 板 3
- PIN 2
- 14
- 15
- 16
- PIN 3
- RS485_Shiled
- DB9
- (near JP9#2) 校验 OK
- J1-27 PWM OUTPUT
- B1_J3_PIN2
- 1W
- (near JP9#2) TO DMM
- (near JP10#2) 板 4
- B1_J3_PIN12
- TO DMM - DB50 PIN47
- COMB-L
- COMB-H
- COMA-L
- COMA-H
- (经过MOS管_PWM高驱)
- (直连_PWM低驱)
- JP3B
- PWM & DCV INPUT
- JP3C
- (near JP10#2) TO DMM
- (near JP10#2) 校验 OK
- DMM电压测量扩展
- 6R=1
- L=
- 10R=1
- (near JP1#4) PWM output
- 6R=2
- 10R=2
- 10R=7
- 6R=3
- 10R=15
- 10R=5
- Labels drawn without touching a wire or pin: J1_P29, J1_P40, J1_P44, J1_P46, J2_2, J2_3, J2_4, J2_5, J2_6, J2_9, J2_10, J2_12, J2_13, J2_14_PWM, J2_25, J2_26, J2_27_PWM, J2_30, J2_34_PWM, J2_37, J2_38, J2_39, J2_40_PWM, J2_41_PWM, J2_42_PWM, J2_44_PWM, J2_45_PWM, J2_47-2, J2_47-3, J2_50, J2_51, J2_52, J3_26_PWM, J3_27_PWM, J3_28_PWM, J5_16_PWM, J5_46_PWM, J6_1, J6_3, J6_4, J6_5, J6_9_PWM, J6_10_PWM, J6_11, J7_1, J7_2, J7_11, J7_12, J7_13, J9_1_PWM, J9_2, J9_3, J9_4, J9_21_PWM, J9_22, J9_24, J9_25, K1, K2, K3, K4, K5, K6, K7, K8, K9, K10, K11, K12, K13, K14, K15, K16
- Document Number:
- Rev:
- Project Name:
- Drawn By:
- Date:
- Titile:
- Checked By:
- Sheet:
- Of

### Library data of the parts
JP1#4 P1#2 = CON2-3.81

## Nets that join several sheets
BAT_GND: 1_wiring drawing (27 pins), 2_wiring drawing (16 pins), 3_wiring drawing (20 pins), 4_wiring drawing (17 pins), 5_wiring drawing (P1#2.2)
BAT: 1_wiring drawing (J2.1 R5#1.2), 2_wiring drawing (7 pins), 3_wiring drawing (17 pins), 4_wiring drawing (6 pins)
J1_P1: 3_wiring drawing (J1-1.1 JP9#1.23 R144.1), 5_wiring drawing (JP9#2.23)
J1_P14: 3_wiring drawing (J1-1.14 JP9#1.25 R146.1), 5_wiring drawing (JP9#2.25)
J1_P15: 3_wiring drawing (J1-1.15 JP9#1.27 R147.1), 5_wiring drawing (JP9#2.27)
J1_P16: 3_wiring drawing (J1-1.16 JP9#1.29 R148.1), 5_wiring drawing (JP9#2.29)
J1_P17: 3_wiring drawing (J1-1.17 JP9#1.26 R149.1), 5_wiring drawing (JP9#2.26)
J1_P27: 3_wiring drawing (J1-1.27 JP9#1.28 R150.1), 5_wiring drawing (JP9#2.28)
J1_P40: 3_wiring drawing (J1-1.40 JP9#1.30 R151.1), 5_wiring drawing (JP9#2.30)
J2_2: 1_wiring drawing (J2-1.2 JP1#1.1 R1#1.1), 5_wiring drawing (JP1#3.1)
J2_3: 1_wiring drawing (J2-1.3 JP1#1.3 R2#1.1), 5_wiring drawing (JP1#3.3)
J2_4: 1_wiring drawing (J2-1.4 JP1#1.5 R3#1.1), 5_wiring drawing (JP1#3.5)
J2_5: 1_wiring drawing (J2-1.5 JP1#1.7 R4#1.1), 5_wiring drawing (JP1#3.7)
J2_6: 1_wiring drawing (J2-1.6 JP1#1.9 R5#1.1), 5_wiring drawing (JP1#3.9)
J2_9: 1_wiring drawing (J2-1.9 JP1#1.11 R8#1.1), 5_wiring drawing (JP1#3.11)
J2_10: 1_wiring drawing (J2-1.10 JP1#1.13 R9#1.1), 5_wiring drawing (JP1#3.13)
J2_12: 1_wiring drawing (J2-1.12 JP1#1.15 R19#1.1), 5_wiring drawing (JP1#3.15)
J2_13: 1_wiring drawing (J2-1.13 JP1#1.17 R10#1.1), 5_wiring drawing (JP1#3.17)
J2_25: 1_wiring drawing (J2-1.25 JP1#1.19 R20.1), 5_wiring drawing (JP1#3.19)
J2_26: 1_wiring drawing (J2-1.26 JP1#1.6 R22.1), 5_wiring drawing (JP1#3.6)
J2_37: 1_wiring drawing (J2-2.1 JP1#1.8 R24.1), 5_wiring drawing (JP1#3.8)
J2_38: 1_wiring drawing (J2-2.2 JP1#1.10 R26.1), 5_wiring drawing (JP1#3.10)
J2_39: 1_wiring drawing (J2-2.3 JP1#1.2 R11#1.1), 5_wiring drawing (JP1#3.2)
J2_50: 1_wiring drawing (5 pins), 5_wiring drawing (JP1#3.4)
J3_6: 3_wiring drawing (J3-1.6 JP9#1.1 R119.1), 5_wiring drawing (JP9#2.1)
J3_10: 3_wiring drawing (J3-1.10 JP9#1.3 R120.1), 5_wiring drawing (JP9#2.3)
J3_11: 3_wiring drawing (J3-1.11 JP9#1.5 R121.1), 5_wiring drawing (JP9#2.5)
J3_12: 3_wiring drawing (J3-1.12 JP9#1.7 R122.1), 5_wiring drawing (JP9#2.7)
J3_13: 3_wiring drawing (J3-1.13 JP9#1.9 R123.1), 5_wiring drawing (JP9#2.9)
J3_14: 3_wiring drawing (J3-1.14 JP9#1.2 R124.1), 5_wiring drawing (JP9#2.2)
J3_15: 3_wiring drawing (J3-1.15 JP9#1.4 R125.1), 5_wiring drawing (JP9#2.4)
J3_16: 3_wiring drawing (J3-1.16 JP9#1.6 R126.1), 5_wiring drawing (JP9#2.6)
J3_25: 3_wiring drawing (J3-1.25 JP9#1.8 R128.1), 5_wiring drawing (JP9#2.8)
J3_30: 3_wiring drawing (J3-1.30 JP9#1.10 R127.1), 5_wiring drawing (JP9#2.10)
J3_32: 3_wiring drawing (J3-1.32 JP9#1.12 R127A.1), 5_wiring drawing (JP9#2.12)
J4_1: 2_wiring drawing (5 pins), 5_wiring drawing (JP7#2.18)
J4_2: 2_wiring drawing (5 pins), 5_wiring drawing (JP7#2.20)
J4_3: 2_wiring drawing (J4-1.3 J14#1.7 J14#2.7 JP6#1.13), 4_wiring drawing (R18.2), 5_wiring drawing (JP6#2.13)
J4_5: 2_wiring drawing (5 pins), 5_wiring drawing (JP6#2.14)
J4_6: 2_wiring drawing (5 pins), 5_wiring drawing (JP7#2.1)
J4_7: 2_wiring drawing (5 pins), 5_wiring drawing (JP7#2.3)
J4_8: 2_wiring drawing (5 pins), 5_wiring drawing (JP7#2.5)
J4_9: 2_wiring drawing (5 pins), 5_wiring drawing (JP7#2.7)
J4_10: 2_wiring drawing (5 pins), 5_wiring drawing (JP7#2.9)
J4_11: 2_wiring drawing (5 pins), 5_wiring drawing (JP7#2.11)
J4_12: 2_wiring drawing (5 pins), 5_wiring drawing (JP7#2.13)
J4_13: 2_wiring drawing (5 pins), 5_wiring drawing (JP7#2.15)
J4_15: 2_wiring drawing (J4-1.15 JP7#1.2 R76.1), 5_wiring drawing (JP7#2.2)
J4_16: 2_wiring drawing (J4-1.16 JP7#1.4 R77.1), 5_wiring drawing (JP7#2.4)
J4_17: 2_wiring drawing (J4-1.17 JP7#1.6 R78.1), 5_wiring drawing (JP7#2.6)
J4_18: 2_wiring drawing (J4-1.18 JP7#1.8 R79.1), 5_wiring drawing (JP7#2.8)
J4_19: 2_wiring drawing (5 pins), 5_wiring drawing (JP7#2.17)
J4_20: 2_wiring drawing (5 pins), 5_wiring drawing (JP7#2.19)
J4_22: 2_wiring drawing (5 pins), 5_wiring drawing (JP7#2.10)
J4_23: 2_wiring drawing (5 pins), 5_wiring drawing (JP7#2.12)
J4_24: 2_wiring drawing (5 pins), 5_wiring drawing (JP7#2.14)
J4_25: 2_wiring drawing (5 pins), 5_wiring drawing (JP7#2.16)
J5_2: 2_wiring drawing (J5-1.2 JP6#1.1 R80.1), 5_wiring drawing (JP6#2.1)
J5_3: 2_wiring drawing (J5-1.3 JP6#1.3 R81.1), 5_wiring drawing (JP6#2.3)
J5_4: 2_wiring drawing (J5-1.4 JP6#1.5 R82.1), 5_wiring drawing (JP6#2.5)
J5_5: 2_wiring drawing (J5-1.5 JP6#1.7 R83.1), 5_wiring drawing (JP6#2.7)
J5_6: 2_wiring drawing (J5-1.6 JP6#1.9 R84.1), 5_wiring drawing (JP6#2.9)
J5_7: 2_wiring drawing (J5-1.7 JP6#1.11 R85.1), 5_wiring drawing (JP6#2.11)
J5_10: 2_wiring drawing (J5-1.10 JP6#1.2 R91.1 R92.1), 5_wiring drawing (JP6#2.2)
J5_15: 2_wiring drawing (J5-1.15 JP6#1.4 R89.1), 5_wiring drawing (JP6#2.4)
J5_16: 2_wiring drawing (J5-1.16 JP6#1.6 R86.1), 5_wiring drawing (JP6#2.6)
J5_42: 2_wiring drawing (J5-2.14 JP6#1.8 R87.1), 5_wiring drawing (JP6#2.8)
J5_43: 2_wiring drawing (J5-2.15 JP6#1.10 R90.1), 5_wiring drawing (JP6#2.10)
J5_44: 2_wiring drawing (J5-2.16 JP6#1.12 R88.1), 5_wiring drawing (JP6#2.12)
J6_1: 4_wiring drawing (5 pins), 5_wiring drawing (JP10#2.17)
J6_2: 4_wiring drawing (5 pins), 5_wiring drawing (JP10#2.19)
J6_3: 4_wiring drawing (7 pins), 5_wiring drawing (JP10#2.20)
J6_4: 4_wiring drawing (6 pins), 5_wiring drawing (JP10#2.18)
J6_5: 4_wiring drawing (J6.5 JP10#1.16 R158.1), 5_wiring drawing (JP10#2.16)
J6_11: 4_wiring drawing (J6.11 JP10#1.15 R159.1), 5_wiring drawing (JP10#2.15)
J7_1: 1_wiring drawing (J7.1 JP1#1.12 R21.1), 5_wiring drawing (JP1#3.12)
J7_2: 1_wiring drawing (J7.2 JP1#1.14 R23.1), 5_wiring drawing (JP1#3.14)
J7_11: 1_wiring drawing (J7.11 JP1#1.16 R25.1), 5_wiring drawing (JP1#3.16)
J7_12: 1_wiring drawing (J7.12 JP1#1.18 R27.1), 5_wiring drawing (JP1#3.18)
J7_13: 1_wiring drawing (J7.13 JP1#1.20 R28.1), 5_wiring drawing (JP1#3.20)
J8_1: 3_wiring drawing (5 pins), 5_wiring drawing (JP9#2.11)
J8_2: 3_wiring drawing (5 pins), 5_wiring drawing (JP9#2.14)
J8_3: 3_wiring drawing (5 pins), 5_wiring drawing (JP9#2.13)
J8_4: 3_wiring drawing (J8-1.4 JP9#1.16 R129.1), 5_wiring drawing (JP9#2.16)
J8_5: 3_wiring drawing (5 pins), 5_wiring drawing (JP9#2.15)
J8_6: 3_wiring drawing (J8-1.6 JP9#1.18 R130.1), 5_wiring drawing (JP9#2.18)
J8_7: 3_wiring drawing (J8-1.7 JP9#1.17 R130.2), 5_wiring drawing (JP9#2.17)
J8_8: 3_wiring drawing (J8-1.8 JP9#1.20 R131.1), 5_wiring drawing (JP9#2.20)
J8_9: 3_wiring drawing (J8-1.9 JP9#1.19 R142.2), 5_wiring drawing (JP9#2.19)
J8_10: 3_wiring drawing (J8-1.10 JP9#1.22 R142.1 R143.1), 5_wiring drawing (JP9#2.22)
J8_11: 3_wiring drawing (J8-1.11 JP9#1.21 R132.1), 5_wiring drawing (JP9#2.21)
J8_12: 3_wiring drawing (J8-1.12 JP9#1.24 R143.2), 5_wiring drawing (JP9#2.24)
J9_5: 4_wiring drawing (J9.5 JP10#1.1 R155.1), 5_wiring drawing (JP10#2.1)
J9_6: 4_wiring drawing (J9.6 JP10#1.3 R152.1), 5_wiring drawing (JP10#2.3)
J9_7: 4_wiring drawing (J9.7 JP10#1.5 R153.1), 5_wiring drawing (JP10#2.5)
J9_8: 4_wiring drawing (J9.9 JP10#1.9 R153a.1), 5_wiring drawing (JP10#2.9)
J9_9: 4_wiring drawing (J9.8 JP10#1.10 R153b.1), 5_wiring drawing (JP10#2.10)
J9_10: 4_wiring drawing (J9.10 JP10#1.8 R153c.1), 5_wiring drawing (JP10#2.8)
J9_11: 4_wiring drawing (J9.11 JP10#1.7 R156.1), 5_wiring drawing (JP10#2.7)
J9_20: 4_wiring drawing (5 pins), 5_wiring drawing (JP10#2.2)
J9_23: 4_wiring drawing (J9.23 JP10#1.4 R154.1), 5_wiring drawing (JP10#2.4)
J9_40: 4_wiring drawing (5 pins), 5_wiring drawing (JP10#2.6)